# EAGLE board Blade (EAGLE 9.3.1), part 1 of 2
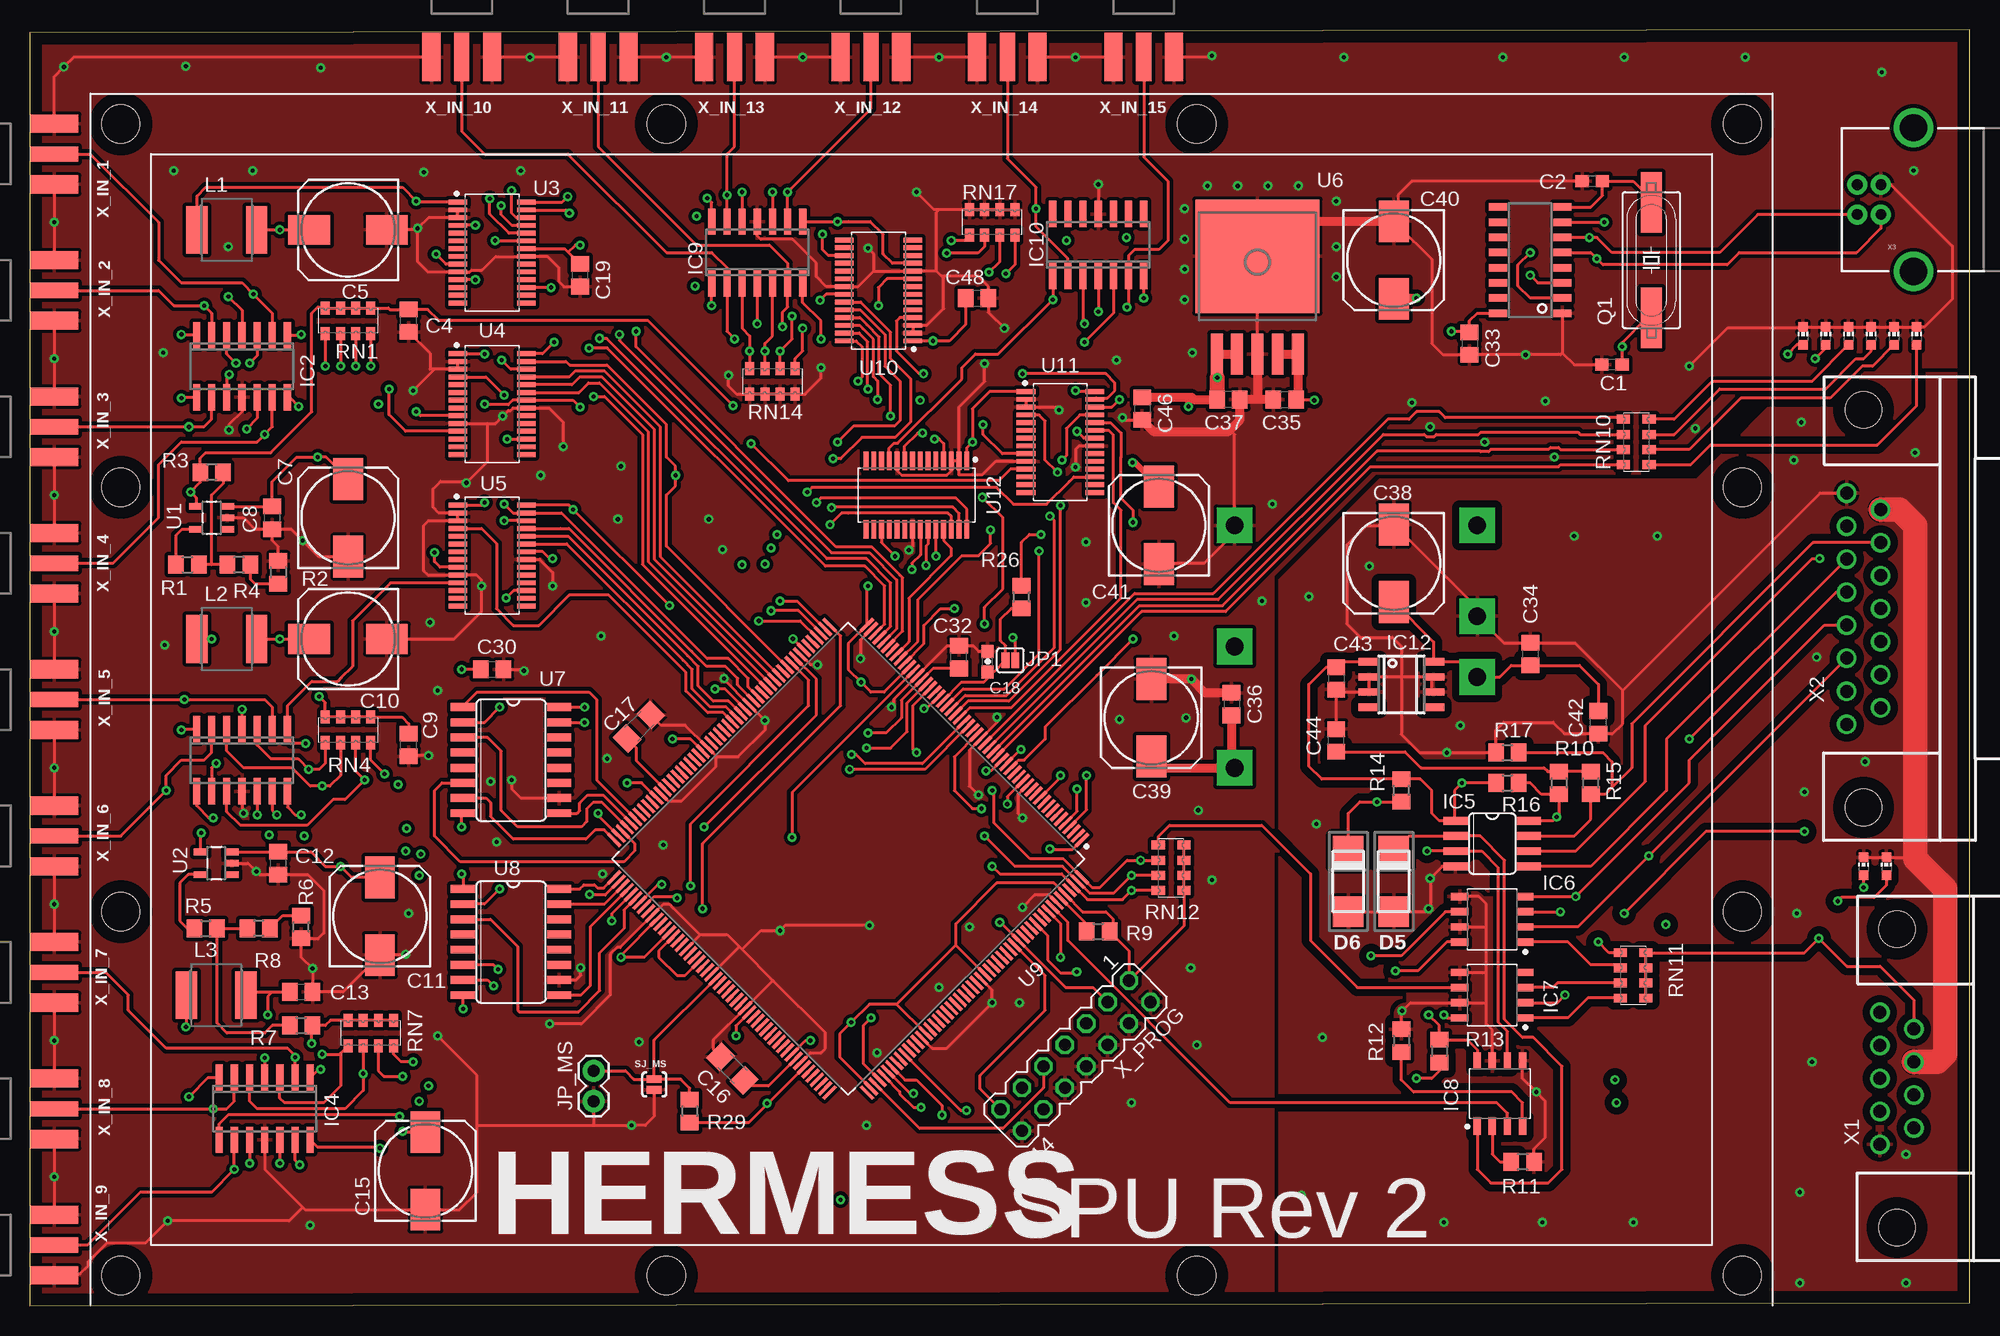
[diagram p8: board, top side]
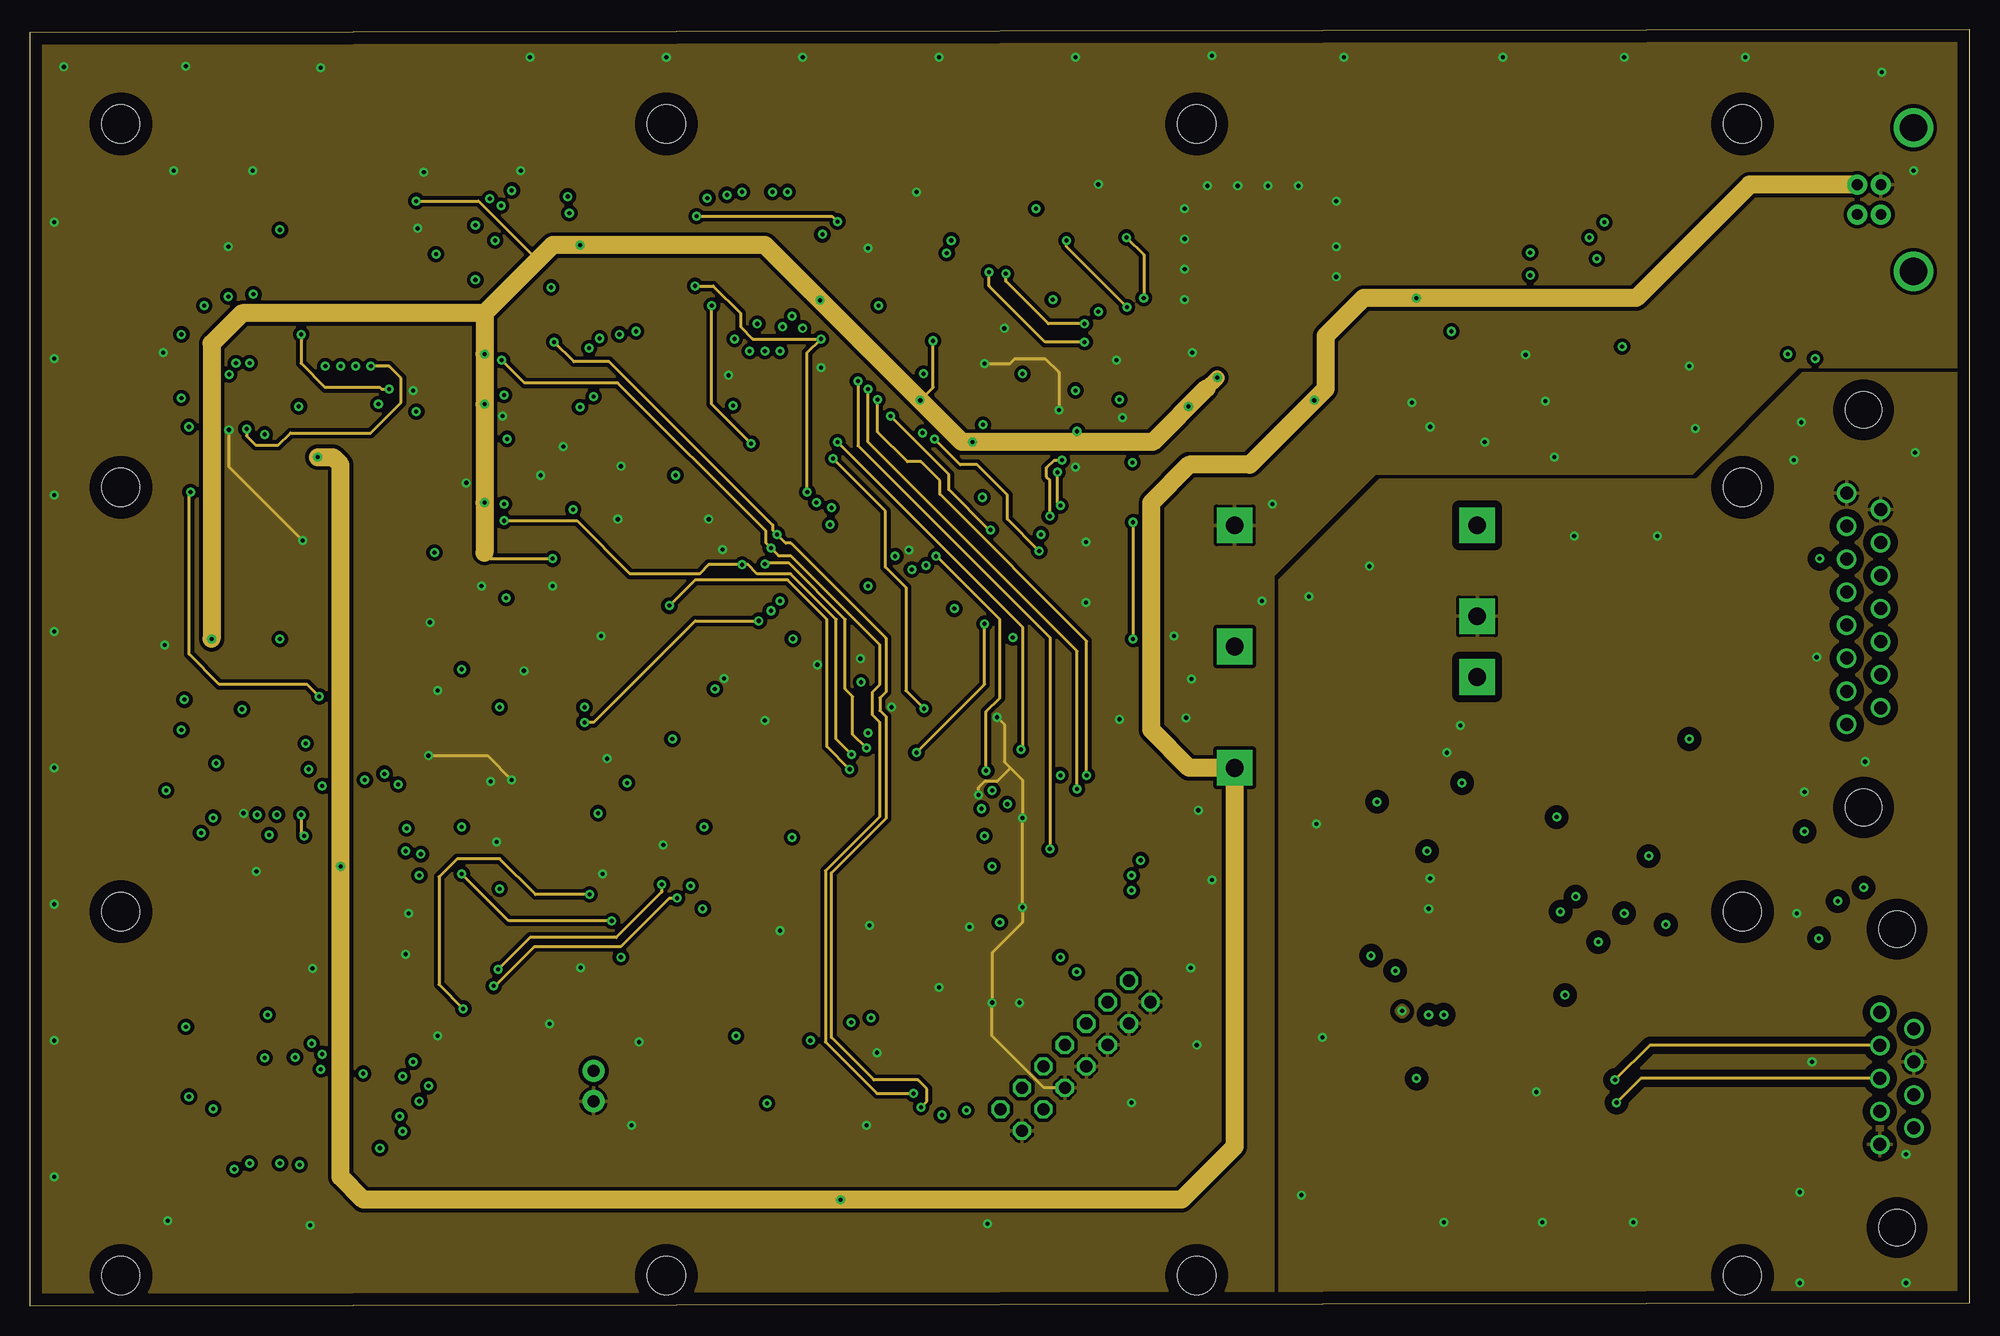
[diagram p9: board, inner layer Route2]
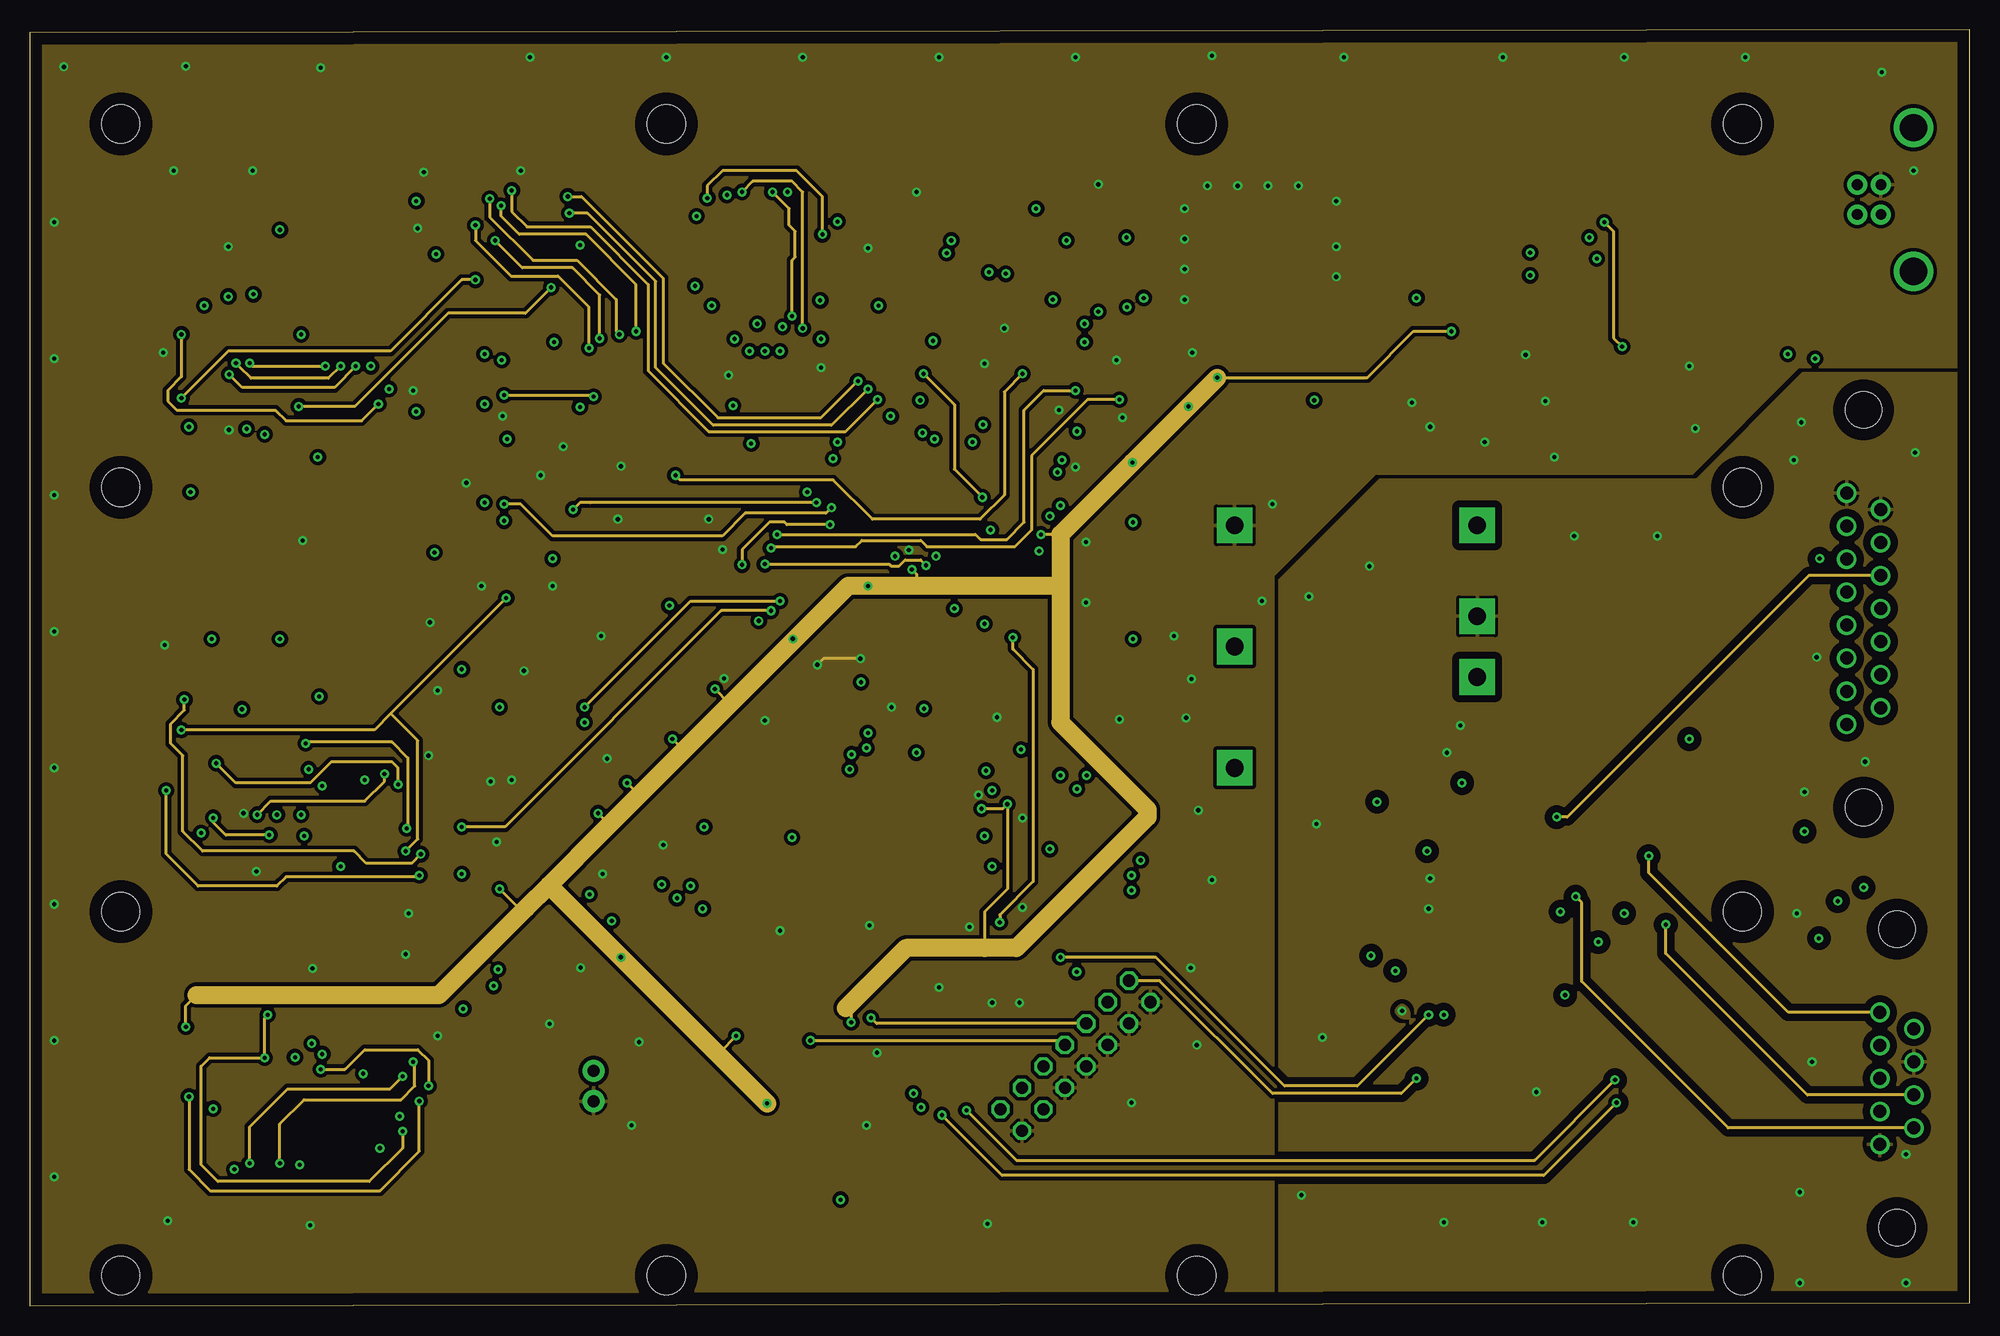
[diagram p10: board, inner layer Route15]
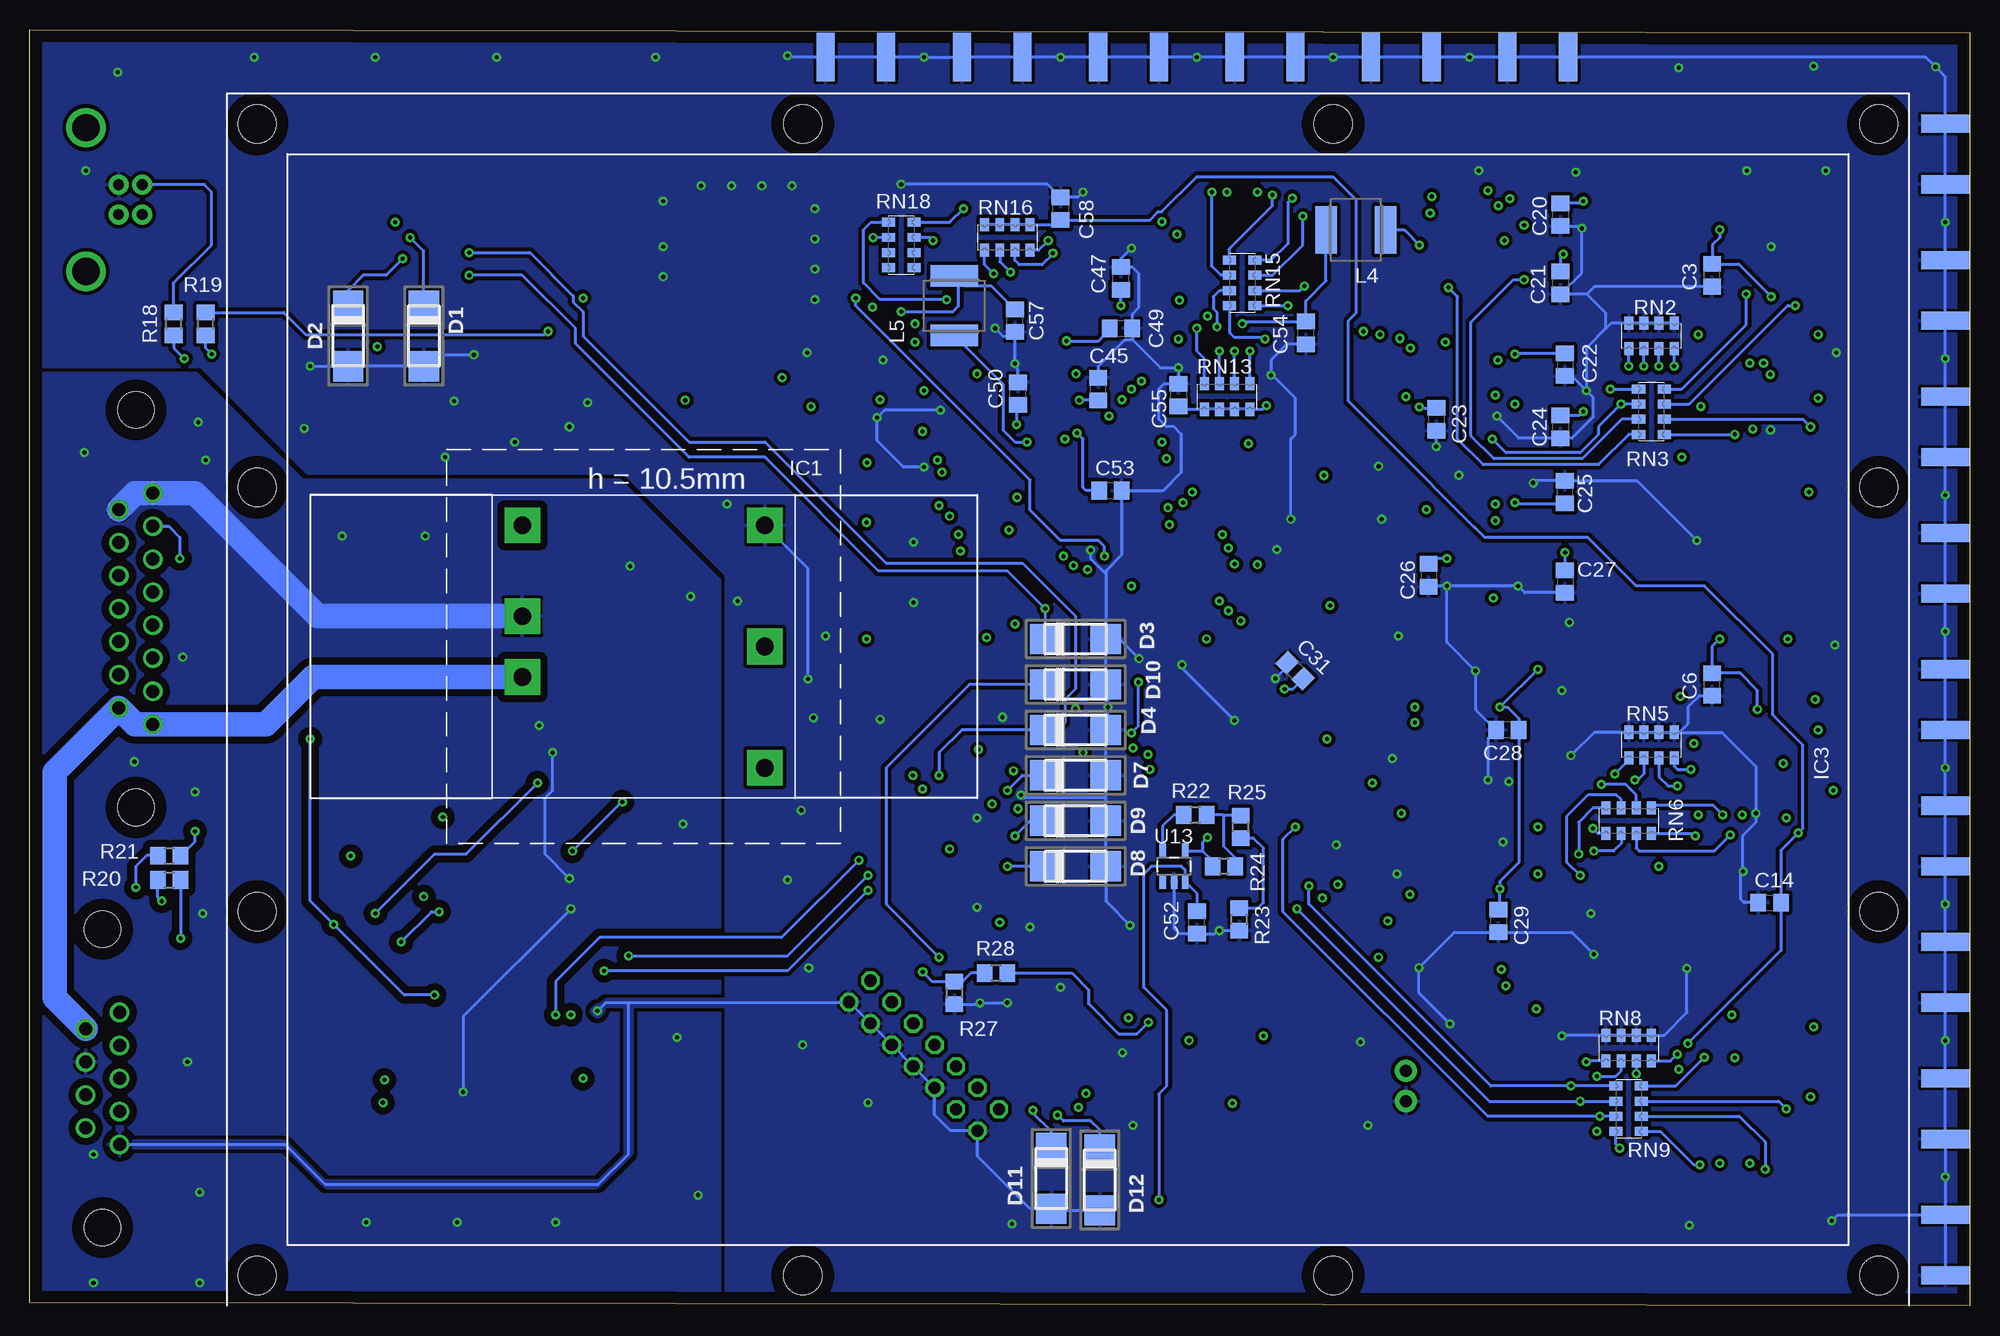
[diagram p11: board, bottom side, seen from below]

Size 162.56 x 106.93 mm. Coordinates in mm from the lower left corner, seen from the top.
Outline: 0,0 162.56,0.25 162.56,106.93 0,106.68 0,0
Copper layers (1+2+15+16): Top 0.035mm / dielectric 0.2mm / Route2 0.017mm / dielectric 0.2mm / Route15 0.017mm / dielectric 0.2mm / Bottom 0.035mm
Design rules "default *": minimum track width 10mil, minimum drill 0.35mm, track to track 9mil, track to pad 8mil, pad to pad 8mil, via to via 12mil, smd to smd 6mil, copper to edge 40mil, drill to drill 6mil, minimum pad ring 10mil, minimum via ring 8mil, stop-mask expansion 4mil, vias tented up to drill 0mil, thermal gap 10mil
Holes 3.2 mm at 7.62,99.06 7.62,2.54 143.51,2.54 143.51,99.06 53.34,99.06 97.79,99.06 53.34,2.54 97.79,2.54 7.62,68.58 7.62,33.02 143.51,33.02 143.51,68.58
tKeepout: area 5.1,0 to 146.1,101.6

## Footprints (pad centres in the part's own frame; a part is rotated, then mirrored left to right if it is on the bottom)
C0603 = smd 1.1 x 1: 1 -0.85,0; 2 0.85,0
C0805 = smd 1.3 x 1.5: 1 -0.95,0; 2 0.95,0
153CLV-0810 = smd 3.5 x 2.5: + 3.25,0; - -3.25,0
C1206 = smd 1.6 x 1.8: 1 -1.4,0; 2 1.4,0
0603-CAP = smd 1.1 x 1: 1 -0.85,0; 2 0.85,0
DMELF = smd 2.54 x 2.54: A -2.54,0; C 2.54,0
THL_20WI_SERIES = drill 1.5 pad 3 square: 1 -2.54,10.16; 2 2.54,10.16; 3 -10.16,-10.16; 4 0,-10.16; 5 10.16,-10.16; 6 10.16,10.16
SO14 = smd 0.6 x 2.2: 1 -3.81,-2.6; 2 -2.54,-2.6; 3 -1.27,-2.6; 4 0,-2.6; 5 1.27,-2.6; 6 2.54,-2.6; 7 3.81,-2.6; 8 3.81,2.6; 9 2.54,2.6; 10 1.27,2.6; 11 0,2.6; 12 -1.27,2.6; 13 -2.54,2.6; 14 -3.81,2.6
SO08 = smd 0.66 x 2.032: 1 -1.905,-3.073; 2 -0.635,-3.073; 3 0.635,-3.073; 4 1.905,-3.073; 5 1.905,3.073; 6 0.635,3.073; 7 -0.635,3.073; 8 -1.905,3.073
SOIC127P594X363-8N = smd 1.44 x 0.614: 1 -2.731,1.905; 2 -2.731,0.635; 3 -2.731,-0.635; 4 -2.731,-1.905; 5 2.731,-1.905; 6 2.731,-0.635; 7 2.731,0.635; 8 2.731,1.905
SOIC8 = smd 0.6 x 1.8: 1 -1.905,-2.7; 2 -0.635,-2.7; 3 0.635,-2.7; 4 1.905,-2.7; 5 1.905,2.7; 6 0.635,2.7; 7 -0.635,2.7; 8 -1.905,2.7
SOIC16 = smd 0.635 x 1.524: 1 -4.445,-2.695; 2 -3.175,-2.695; 3 -1.905,-2.695; 4 -0.635,-2.695; 5 0.635,-2.695; 6 1.905,-2.695; 7 3.175,-2.695; 8 4.445,-2.695; 9 4.445,2.695; 10 3.175,2.695; 11 1.905,2.695; 12 0.635,2.695; 13 -0.635,2.695; 14 -1.905,2.695; 15 -3.175,2.695; 16 -4.445,2.695
SMT-JUMPER_2_NC_PASTE_SILK = smd 0.635 x 1.27: 1 -0.406,0; 2 0.406,0
1X02 = drill 1.016 pad 1.88: 1 0,0; 2 2.54,0
L5650M = smd 1.8 x 4: 1 -2.5,0; 2 2.5,0
CHIP-LED0603 = smd 0.8 x 0.8: A 0,-0.75; C 0,0.75
SM49 = smd 5.08 x 1.778: 1 -4.826,0; 2 4.826,0
R0805 = smd 1.3 x 1.5: 1 -0.95,0; 2 0.95,0
EXBS8V = smd 0.75 x 1.1: 1 -1.905,-1.07; 2 -0.635,-1.07; 3 0.635,-1.07; 4 1.905,-1.07; 5 1.905,1.07; 6 0.635,1.07; 7 -0.635,1.07; 8 -1.905,1.07
SJ_2S-NO = smd 0.635 x 1.27: 1 -0.45,0; 2 0.45,0
SOT23-5 = smd 0.55 x 1.2: 1 -0.95,-1.3; 2 0,-1.3; 3 0.95,-1.3; 4 0.95,1.3; 5 -0.95,1.3
TSSOP28 = smd 1.572 x 0.407: 1 -2.872,4.225; 2 -2.872,3.575; 3 -2.872,2.925; 4 -2.872,2.275; 5 -2.872,1.625; 6 -2.872,0.975; 7 -2.872,0.325; 8 -2.872,-0.325; 9 -2.872,-0.975; 10 -2.872,-1.625; 11 -2.872,-2.275; 12 -2.872,-2.925; 13 -2.872,-3.575; 14 -2.872,-4.225; 15 2.872,-4.225; 16 2.872,-3.575; 17 2.872,-2.925; 18 2.872,-2.275; 19 2.872,-1.625; 20 2.872,-0.975; 21 2.872,-0.325; 22 2.872,0.325; 23 2.872,0.975; 24 2.872,1.625; 25 2.872,2.275; 26 2.872,2.925; 27 2.872,3.575; 28 2.872,4.225
Q5-DD = smd 1 x 3.4: 1 -3.4,-7.875; 2 -1.7,-7.875; 3 0,-7.875; 4 1.7,-7.875; 5 3.4,-7.875 | smd 10.414 x 9.525: 6 0,0.325
SO16 = smd 0.66 x 2.032: 1 -4.445,-3.073; 2 -3.175,-3.073; 3 -1.905,-3.073; 4 -0.635,-3.073; 5 0.635,-3.073; 6 1.905,-3.073; 7 3.175,-3.073; 8 4.445,-3.073; 9 4.445,4.978; 10 3.175,4.978; 11 1.905,4.978; 12 0.635,4.978; 13 -0.635,4.978; 14 -1.905,4.978; 15 -3.175,4.978; 16 -4.445,4.978
QFP50P3060X3060X385-208 = smd 1.469 x 0.28: 1 -14.971,12.75; 2 -14.971,12.25; 3 -14.971,11.75; 4 -14.971,11.25; 5 -14.971,10.75; 6 -14.971,10.25; 7 -14.971,9.75; 8 -14.971,9.25; 9 -14.971,8.75; 10 -14.971,8.25; 11 -14.971,7.75; 12 -14.971,7.25; 13 -14.971,6.75; 14 -14.971,6.25; 15 -14.971,5.75; 16 -14.971,5.25; 17 -14.971,4.75; 18 -14.971,4.25; 19 -14.971,3.75; 20 -14.971,3.25; 21 -14.971,2.75; 22 -14.971,2.25; 23 -14.971,1.75; 24 -14.971,1.25; 25 -14.971,0.75; 26 -14.971,0.25; 27 -14.971,-0.25; 28 -14.971,-0.75; 29 -14.971,-1.25; 30 -14.971,-1.75; 31 -14.971,-2.25; 32 -14.971,-2.75; 33 -14.971,-3.25; 34 -14.971,-3.75; 35 -14.971,-4.25; 36 -14.971,-4.75; 37 -14.971,-5.25; 38 -14.971,-5.75; 39 -14.971,-6.25; 40 -14.971,-6.75; 41 -14.971,-7.25; 42 -14.971,-7.75; 43 -14.971,-8.25; 44 -14.971,-8.75; 45 -14.971,-9.25; 46 -14.971,-9.75; 47 -14.971,-10.25; 48 -14.971,-10.75; 49 -14.971,-11.25; 50 -14.971,-11.75; 51 -14.971,-12.25; 52 -14.971,-12.75; 105 14.971,-12.75; 106 14.971,-12.25; 107 14.971,-11.75; 108 14.971,-11.25; 109 14.971,-10.75; 110 14.971,-10.25; 111 14.971,-9.75; 112 14.971,-9.25; 113 14.971,-8.75; 114 14.971,-8.25; 115 14.971,-7.75; 116 14.971,-7.25; 117 14.971,-6.75; 118 14.971,-6.25; 119 14.971,-5.75; 120 14.971,-5.25; 121 14.971,-4.75; 122 14.971,-4.25; 123 14.971,-3.75; 124 14.971,-3.25; 125 14.971,-2.75; 126 14.971,-2.25; 127 14.971,-1.75; 128 14.971,-1.25; 129 14.971,-0.75; 130 14.971,-0.25; 131 14.971,0.25; 132 14.971,0.75; 133 14.971,1.25; 134 14.971,1.75; 135 14.971,2.25; 136 14.971,2.75; 137 14.971,3.25; 138 14.971,3.75; 139 14.971,4.25; 140 14.971,4.75; 141 14.971,5.25; 142 14.971,5.75; 143 14.971,6.25; 144 14.971,6.75; 145 14.971,7.25; 146 14.971,7.75; 147 14.971,8.25; 148 14.971,8.75; 149 14.971,9.25; 150 14.971,9.75; 151 14.971,10.25; 152 14.971,10.75; 153 14.971,11.25; 154 14.971,11.75; 155 14.971,12.25; 156 14.971,12.75 | smd 0.28 x 1.469: 53 -12.75,-14.971; 54 -12.25,-14.971; 55 -11.75,-14.971; 56 -11.25,-14.971; 57 -10.75,-14.971; 58 -10.25,-14.971; 59 -9.75,-14.971; 60 -9.25,-14.971; 61 -8.75,-14.971; 62 -8.25,-14.971; 63 -7.75,-14.971; 64 -7.25,-14.971; 65 -6.75,-14.971; 66 -6.25,-14.971; 67 -5.75,-14.971; 68 -5.25,-14.971; 69 -4.75,-14.971; 70 -4.25,-14.971; 71 -3.75,-14.971; 72 -3.25,-14.971; 73 -2.75,-14.971; 74 -2.25,-14.971; 75 -1.75,-14.971; 76 -1.25,-14.971; 77 -0.75,-14.971; 78 -0.25,-14.971; 79 0.25,-14.971; 80 0.75,-14.971; 81 1.25,-14.971; 82 1.75,-14.971; 83 2.25,-14.971; 84 2.75,-14.971; 85 3.25,-14.971; 86 3.75,-14.971; 87 4.25,-14.971; 88 4.75,-14.971; 89 5.25,-14.971; 90 5.75,-14.971; 91 6.25,-14.971; 92 6.75,-14.971; 93 7.25,-14.971; 94 7.75,-14.971; 95 8.25,-14.971; 96 8.75,-14.971; 97 9.25,-14.971; 98 9.75,-14.971; 99 10.25,-14.971; 100 10.75,-14.971; 101 11.25,-14.971; 102 11.75,-14.971; 103 12.25,-14.971; 104 12.75,-14.971; 157 12.75,14.971; 158 12.25,14.971; 159 11.75,14.971; 160 11.25,14.971; 161 10.75,14.971; 162 10.25,14.971; 163 9.75,14.971; 164 9.25,14.971; 165 8.75,14.971; 166 8.25,14.971; 167 7.75,14.971; 168 7.25,14.971; 169 6.75,14.971; 170 6.25,14.971; 171 5.75,14.971; 172 5.25,14.971; 173 4.75,14.971; 174 4.25,14.971; 175 3.75,14.971; 176 3.25,14.971; 177 2.75,14.971; 178 2.25,14.971; 179 1.75,14.971; 180 1.25,14.971; 181 0.75,14.971; 182 0.25,14.971; 183 -0.25,14.971; 184 -0.75,14.971; 185 -1.25,14.971; 186 -1.75,14.971; 187 -2.25,14.971; 188 -2.75,14.971; 189 -3.25,14.971; 190 -3.75,14.971; 191 -4.25,14.971; 192 -4.75,14.971; 193 -5.25,14.971; 194 -5.75,14.971; 195 -6.25,14.971; 196 -6.75,14.971; 197 -7.25,14.971; 198 -7.75,14.971; 199 -8.25,14.971; 200 -8.75,14.971; 201 -9.25,14.971; 202 -9.75,14.971; 203 -10.25,14.971; 204 -10.75,14.971; 205 -11.25,14.971; 206 -11.75,14.971; 207 -12.25,14.971; 208 -12.75,14.971
H5M09RA = drill 1.092: 1 -5.537,1.422; 2 -2.769,1.422; 3 0,1.422; 4 2.769,1.422; 5 5.537,1.422; 6 -4.153,-1.422; 7 -1.384,-1.422; 8 1.384,-1.422; 9 4.153,-1.422 | hole 3.048: -12.497,0; 12.497,0
H5M15RA = drill 1.092: 1 -9.69,1.422; 2 -6.921,1.422; 3 -4.153,1.422; 4 -1.384,1.422; 5 1.384,1.422; 6 4.153,1.422; 7 6.921,1.422; 8 9.69,1.422; 9 -8.306,-1.422; 10 -5.537,-1.422; 11 -2.769,-1.422; 12 0,-1.422; 13 2.769,-1.422; 14 5.537,-1.422; 15 8.306,-1.422 | hole 3.048: -16.662,0; 16.662,0
USB-B-PTH = drill 0.914 pad 1.676: D+ 0,1.25; D- 1.981,1.25; GND 0,-1.25; VBUS 1.981,-1.25 | drill 2.286: S1 -2.718,-6.02; S2 -2.718,6.02
SMA_EDGELAUNCH = smd 4.064 x 1.524: GND@1 2.032,-2.54; GND@2 2.032,2.54 | smd 4.064 x 1.524 bottom: GND@3 2.032,2.54; GND@4 2.032,-2.54 | smd 4.064 x 1.27: P 2.032,0
MA07-2 = drill 1.016 octagon: 1 -7.62,-1.27; 2 -7.62,1.27; 3 -5.08,-1.27; 4 -5.08,1.27; 5 -2.54,-1.27; 6 -2.54,1.27; 7 0,-1.27; 8 0,1.27; 9 2.54,-1.27; 10 2.54,1.27; 11 5.08,-1.27; 12 5.08,1.27; 13 7.62,-1.27; 14 7.62,1.27

## Placement (x,y rotation side)
C1  22p  [C0603]  132.59,78.87 180 top
C2  22p  [C0603]  130.94,94.23 180 top
C3  10n  [C0805]  21.59,86.36 90 bottom
C4  10u  [C0805]  31.75,82.55 90 top
C5  10u  [153CLV-0810]  26.67,90.17 180 top
C6  10n  [C0805]  21.59,52.07 90 bottom
C7  4u7  [153CLV-0810]  26.67,66.04 90 top
C8  10n  [C0805]  20.32,66.04 90 top
C9  10u  [C0805]  31.75,46.99 90 top
C10  10u  [153CLV-0810]  26.67,55.88 180 top
C11  4u7  [153CLV-0810]  29.34,32.64 90 top
C12  10n  [C0805]  20.83,37.08 90 top
C13  10n  [C0805]  22.73,26.29 180 top
C14  10u  [C0805]  16.76,33.78 0 bottom
C15  10u  [153CLV-0810]  33.15,11.3 90 top
C16  2.2u  [C1206]  58.87,19.87 315 top
C17  2.2u  [C1206]  51.04,48.53 225 top
C18  100n  [0603-CAP]  80.26,53.98 90 top
C19  100n  [C0805]  46.1,86.36 270 top
C20  100n  [C0805]  34.29,91.44 270 bottom
C21  1u  [C0805]  34.29,85.72 270 bottom
C22  100n  [C0805]  33.91,78.87 270 bottom
C23  100n  [C0805]  44.7,74.3 270 bottom
C24  1u  [C0805]  34.29,73.66 270 bottom
C25  100n  [C0805]  33.91,68.2 90 bottom
C26  100n  [C0805]  45.34,61.21 270 bottom
C27  1u  [C0805]  33.91,60.71 270 bottom
C28  100n  [C0805]  38.73,48.26 180 bottom
C29  100n  [C0805]  39.5,32.26 270 bottom
C30  100n  [C0805]  38.73,53.34 0 top
C31  100n  [C0805]  56.52,53.21 135 bottom
C32  100n  [C0805]  77.85,54.36 90 top
C33  100n  [C0805]  120.65,80.64 270 top
C34  100n  [C0805]  125.73,54.61 270 top
C35  100n  [C0805]  105.16,75.95 0 top
C36  100n  [C0805]  100.71,50.42 270 top
C37  100n  [C0805]  100.46,75.95 180 top
C38  10u  [153CLV-0810]  114.3,62.23 270 top
C39  10u  [153CLV-0810]  93.98,49.28 270 top
C40  10u  [153CLV-0810]  114.3,87.63 270 top
C41  10u  [153CLV-0810]  94.61,65.41 90 top
C42  100n  [C0805]  131.44,48.9 90 top
C43  100n  [C0805]  109.47,52.58 270 top
C44  ~0  [C0805]  109.47,47.37 90 top
C45  100n  [C0805]  73.03,76.83 90 bottom
C46  100n  [C0805]  93.22,75.18 270 top
C47  1u  [C0805]  71.12,86.11 90 bottom
C48  100n  [C0805]  79.38,84.45 0 top
C49  100n  [C0805]  71.12,81.92 0 bottom
C50  1u  [C0805]  79.76,76.45 90 bottom
C52  10n  [C0805]  64.77,32.13 90 bottom
C53  1u  [C0805]  72.01,68.33 0 bottom
C54  10n  [C0805]  55.63,81.53 90 bottom
C55  10u  [C0805]  66.29,76.33 270 bottom
C57  10n  [C0805]  80.01,82.55 90 bottom
C58  10u  [C0805]  76.2,91.95 270 bottom
D1  6V  [DMELF]  129.54,81.28 90 bottom
D2  6V  [DMELF]  135.89,81.28 90 bottom
D3  3V6  [DMELF]  74.93,55.88 180 bottom
D4  3V6  [DMELF]  74.93,48.26 180 bottom
D5  6V  [DMELF]  114.3,35.56 90 top
D6  6V  [DMELF]  110.49,35.56 90 top
D7  3V6  [DMELF]  74.93,44.45 180 bottom
D8  3V6  [DMELF]  74.93,36.83 180 bottom
D9  3V6  [DMELF]  74.93,40.64 180 bottom
D10  3V6  [DMELF]  74.93,52.07 180 bottom
D11  3V6  [DMELF]  76.96,10.67 90 bottom
D12  3V6  [DMELF]  72.9,10.54 90 bottom
IC1  THN10-2411WIR  [THL_20WI_SERIES]  111.12,55.24 90 bottom
IC2  MCP6064-E/SL  [SO14]  17.78,78.74 180 top
IC3  MCP6064-E/SL  [SO14]  17.78,45.72 180 top
IC4  MCP6064-E/SL  [SO14]  19.68,16.51 180 top
IC5  MAX488CSA  [SO08]  122.56,38.73 270 top
IC6  MOCD207MSOIC-8  [SOIC127P594X363-8N]  122.56,32.38 180 top
IC7  MOCD207MSOIC-8  [SOIC127P594X363-8N]  122.56,26.04 180 top
IC8  MOCD207MSOIC-8  [SOIC127P594X363-8N]  123.19,17.78 90 top
IC9  MCP6064-E/SL  [SO14]  60.96,88.27 0 top
IC10  MCP6064-E/SL  [SO14]  89.53,88.9 0 top
IC12  LM78L05ACMX/NOPB  [SOIC8]  114.94,52.07 270 top
IC13  CH340G  [SOIC16]  125.73,87.63 90 top
JP1  JUMPER-SMT_2_NC_PASTE_SILK  [SMT-JUMPER_2_NC_PASTE_SILK]  82.17,54.1 0 top
JP_MS  [1X02]  47.24,17.14 90 top
L1  1m  [L5650M]  16.51,90.17 0 top
L2  1m  [L5650M]  16.51,55.88 0 top
L3  1m  [L5650M]  15.62,26.04 0 top
L4  1m  [L5650M]  51.44,90.17 180 bottom
L5  1m  [L5650M]  85.09,83.82 90 bottom
LED1  1V9  [CHIP-LED0603]  152.4,81.28 0 top
LED2  1V9  [CHIP-LED0603]  154.31,81.28 0 top
LED3  1V9  [CHIP-LED0603]  156.21,81.28 0 top
LED4  1V9  [CHIP-LED0603]  158.12,81.28 0 top
LED5  1V9  [CHIP-LED0603]  150.5,81.28 0 top
LED6  1V9  [CHIP-LED0603]  148.59,81.28 0 top
LED7  [CHIP-LED0603]  155.57,36.83 0 top
LED8  [CHIP-LED0603]  153.67,36.83 0 top
Q1  12MHz  [SM49]  135.89,87.63 90 top
R1  100k  [R0805]  13.21,62.1 0 top
R2  1k  [R0805]  20.83,61.47 270 top
R3  ?  [R0805]  15.24,69.85 180 top
R4  ?  [R0805]  17.53,62.1 180 top
R5  100k  [R0805]  14.73,31.62 0 top
R6  1k  [R0805]  22.73,31.75 90 top
R7  ?  [R0805]  22.73,23.5 0 top
R8  ?  [R0805]  19.18,31.62 180 top
R9  10k  [R0805]  89.53,31.37 0 top
R10  500  [R0805]  128.14,43.81 270 top
R11  3k  [R0805]  125.09,12.06 180 top
R12  2k  [R0805]  114.94,22.23 270 top
R13  4k7  [R0805]  118.11,21.34 270 top
R14  7k5  [R0805]  114.94,43.18 90 top
R15  500  [R0805]  130.81,43.81 90 top
R16  3k3  [R0805]  123.83,43.81 0 top
R17  3k3  [R0805]  123.83,46.35 0 top
R18  680  [R0805]  150.5,82.3 90 bottom
R19  330  [R0805]  147.83,82.3 90 bottom
R20  4k7  [R0805]  150.88,35.69 0 bottom
R21  470  [R0805]  150.88,37.72 0 bottom
R22  100k  [R0805]  64.9,41.15 0 bottom
R23  1k  [R0805]  61.21,32.38 90 bottom
R24  ?  [R0805]  62.48,36.83 180 bottom
R25  ?  [R0805]  61.09,40.13 90 bottom
R26  10k  [R0805]  83.11,59.4 90 top
R27  10k  [R0805]  85.09,26.23 270 bottom
R28  99M  [R0805]  81.6,27.88 180 bottom
R29  10k  [R0805]  55.3,16.31 270 top
RN1  ?  [EXBS8V]  26.67,82.55 180 top
RN2  ?  [EXBS8V]  26.67,81.28 0 bottom
RN3  ?  [EXBS8V]  26.67,74.93 90 bottom
RN4  ?  [EXBS8V]  26.67,48.26 180 top
RN5  ?  [EXBS8V]  26.67,46.99 0 bottom
RN6  ?  [EXBS8V]  28.57,40.64 180 bottom
RN7  ?  [EXBS8V]  28.57,22.86 180 top
RN8  ?  [EXBS8V]  28.57,21.59 0 bottom
RN9  ?  [EXBS8V]  28.57,16.51 90 bottom
RN10  330  [EXBS8V]  134.62,72.39 270 top
RN11  3k  [EXBS8V]  134.37,27.69 90 top
RN12  300  [EXBS8V]  95.63,36.7 90 top
RN13  ?  [EXBS8V]  62.23,76.2 0 bottom
RN14  ?  [EXBS8V]  62.23,77.47 180 top
RN15  ?  [EXBS8V]  60.96,85.72 270 bottom
RN16  ?  [EXBS8V]  80.64,89.53 180 bottom
RN17  ?  [EXBS8V]  80.64,90.81 0 top
RN18  ?  [EXBS8V]  89.53,88.9 90 bottom
SJ_MS  [SJ_2S-NO]  52.32,18.54 90 top
U1  ADR366WAUJZ  [SOT23-5]  15.24,66.04 90 top
U2  ADR366WAUJZ  [SOT23-5]  15.62,37.08 90 top
U3  ADS1148QPWRQ1  [TSSOP28]  38.73,88.27 0 top
U4  ADS1148QPWRQ1  [TSSOP28]  38.73,75.56 0 top
U5  ADS1148QPWRQ1  [TSSOP28]  38.73,62.87 0 top
U6  LT1528  [Q5-DD]  102.87,87.63 0 top
U7  S70FL01GS  [SO16]  39.37,45.72 270 top
U8  S70FL01GS  [SO16]  39.37,30.48 270 top
U9  STM32F77XXXLQFP208  [QFP50P3060X3060X385-208]  68.58,37.47 225 top
U10  ADS1148QPWRQ1  [TSSOP28]  71.12,85.09 180 top
U11  ADS1148QPWRQ1  [TSSOP28]  86.36,72.39 0 top
U12  ADS1148QPWRQ1  [TSSOP28]  74.3,67.94 270 top
U13  ADR366WAUJZ  [SOT23-5]  66.67,36.83 0 bottom
X1  D-SUB9-H5M09RA  [H5M09RA]  156.46,19.05 90 top
X2  D-SUB15-H5M15RA  [H5M15RA]  153.67,58.42 90 top
X3  USBPTH  [USB-B-PTH]  155.13,92.71 180 top
X_IN_1  [SMA_EDGELAUNCH]  0,96.52 0 top
X_IN_2  [SMA_EDGELAUNCH]  0,85.09 0 top
X_IN_3  [SMA_EDGELAUNCH]  0,73.66 0 top
X_IN_4  [SMA_EDGELAUNCH]  0,62.23 0 top
X_IN_5  [SMA_EDGELAUNCH]  0,50.8 0 top
X_IN_6  [SMA_EDGELAUNCH]  0,39.37 0 top
X_IN_7  [SMA_EDGELAUNCH]  0,27.94 0 top
X_IN_8  [SMA_EDGELAUNCH]  0,16.51 0 top
X_IN_9  [SMA_EDGELAUNCH]  0,5.08 0 top
X_IN_10  [SMA_EDGELAUNCH]  36.2,106.68 270 top
X_IN_11  [SMA_EDGELAUNCH]  47.62,106.68 270 top
X_IN_12  [SMA_EDGELAUNCH]  70.48,106.68 270 top
X_IN_13  [SMA_EDGELAUNCH]  59.05,106.68 270 top
X_IN_14  [SMA_EDGELAUNCH]  81.92,106.68 270 top
X_IN_15  [SMA_EDGELAUNCH]  93.34,106.68 270 top
X_PROG  [MA07-2]  87.63,20.95 225 top

## Tracks (layer width: path | path; a pad name or v marks a point on that pad's centre or on a via)
3V3  (via drill 0.35)
  Top 0.254: R9.2 90.77,31.08 | 90.77,31.08 92.12,29.73 X_PROG.1 96.7,31.82 RN12.1 RN12.2 RN12.3 RN12.4 | 90.77,31.08 90.77,32.42 90.17,33.02 88.23,33.02 U9.204 85.81,35.43 81.02,35.43 77.59,32.01 77.59,30.23 | R13.2 118.11,19.68 117.47,19.05 v116.2,19.05 | U9.73 58.24,51.69 v57.4,51.69 | C32.1 75.68,53.41 U9.39 73.05,50.77 73.05,50.75 73.03,50.73 73.03,49.28 71.75,48.01 v70.23,48.01 | IC13.16 121.28,83.19 120.65,82.55 C33.1 120.58,81.66 v119.13,81.66 | U9.158 67.86,20.86 67.86,22.77 v68.83,23.75 70.36,25.27 72.64,25.27 | U9.171 72.64,25.27 | 72.64,25.27 77.59,30.23 | U9.185 77.59,30.22 77.59,30.23 | U9.83 55.37,47.5 v53.85,47.5 | U9.94 51.27,43.81 v50.04,43.81 | U9.103 47.62,41.1 v47.62,41.27 | U9.115 49.53,29.38 v49.53,29.21 51.49,29.21 U9.118 | U9.137 59.18,23.47 v59.18,22.61 | U9.150 61.86,16.95 | 61.86,16.95 v61.78,16.95 | U9.15 81.92,42.67 v81.92,42.04 | U9.26 77.47,46 77.47,43.18 78.99,41.66 v79.76,41.66 | U9.42 71.59,51.44 70.48,51.44 v69.66,52.26 68.58,53.34 68.58,55.5 U9.52 70.15,60.24 v70.23,60.33 | U9.59 v63.94,55.89 | U12.1 78.52,71.92 v78.99,72.39 78.99,75.18 80.42,76.61 U11.1 | C48.1 78.42,82.23 77.06,80.86 v75.69,80.86 U10.1 | U10.22 66.73,84.77 v66.23,84.26 | U3.22 44.82,88.59 45.12,88.3 | C19.1 45.12,88.3 | 45.12,88.3 45.72,88.9 v46.1,88.9 | U3.1 32.48,92.49 v32.38,92.58 31.24,93.73 14.73,93.73 14.01,93 L1.1 | U4.1 38.07,79.79 v38.1,79.76 | v39.37,34.92 38.1,33.66 U8.2 | U7.2 38.1,48.9 v39.37,50.16 | U5.22 42.98,63.19 43.56,62.61 v43.81,62.61 | C30.1 v36.2,53.34 | U5.1 37.88,67.09 v38.1,67.31 | v38.1,75.56 38.15,75.52 40.09,75.52 40.46,75.89 U4.22 45.52,75.89 v46.1,75.31 | L2.1 v15.24,55.88
  Top 0.254: L3.1 13.12,23.41 v13.08,23.37 | U12.22 74.62,62.94 73.91,62.23 v73.91,61.7 | U11.22 88.33,72.72 v87.76,73.28 | R26.2 83.11,63.99 83.76,64.64 v84.73,64.64 | R29.2 60.26,15.36 61.86,16.95
  Top 0.508: v97.09,75.37 97.09,75.88 97.35,76.13 | C41.+ 92.6,70.67 v92.39,70.67
  Top 0.762: U6.1 99.57,79.75 | 99.57,79.75 U6.2 | 99.57,79.75 99.44,79.63 99.44,77.78 v99.51,77.78 | C46.1 97.35,76.13 97.54,75.95 C37.2
  Top 1.27: C37.2 v99.51,77.78
  Route2 0.254: v32.38,92.58 37.59,92.58 42.55,87.63 | 38.1,63.12 38.61,62.61 v43.81,62.61 | v74.61,75.88 75.69,76.96 v75.69,80.86 | v87.76,73.28 87.63,73.15 87.63,72.39
  Route2 1.27: 98.62,76.9 v99.51,77.78
  Route2 1.524: 98.62,76.9 94.11,72.39 87.63,72.39 v78.99,72.39 78.11,72.39 v74.61,75.88 v66.23,84.26 61.59,88.9 v46.1,88.9 43.81,88.9 42.55,87.63 38.1,83.19 | 38.1,83.19 17.78,83.19 15.24,80.64 v15.24,55.88 | 38.1,83.19 v38.1,79.76 v38.1,75.56 v38.1,67.31 38.1,63.12
  Route15 0.254: v116.2,19.05 114.94,17.78 104.14,17.78 94.68,27.24 X_PROG.1 | 54.61,46.35 54.61,46.74 v53.85,47.5 | v50.04,43.81 50.8,43.05 50.8,42.55 | v47.62,41.27 48.26,40.64 48.26,40.01 | v59.18,22.61 57.78,21.21 57.78,20.95 | 68.39,24.96 68.83,24.51 v68.83,23.75 | 80.01,29.97 80.01,33.02 81.92,34.92 v81.92,42.04 81.53,41.66 v79.76,41.66 | v63.94,55.89 64.15,55.89 64.77,56.52 | 41.59,33.34 40.96,33.34 v39.37,34.92 | 58.74,50.48 58.61,50.48 v57.4,51.69 | v13.08,23.37 13.08,25.15 13.97,26.04 | v99.51,77.78 112.08,77.78 115.95,81.66 v119.13,81.66 | v73.91,61.7 74.3,61.32 74.3,60.33 | 86.36,64.64 v84.74,64.64 v84.73,64.64
  Route15 1.524: v99.51,77.78 v92.39,70.67 86.36,64.64 86.36,60.33 | 86.36,60.33 86.36,48.9 93.66,41.59 93.66,40.96 82.68,29.97 80.01,29.97 73.41,29.97 68.39,24.96 | 86.36,60.33 74.3,60.33 v70.23,60.33 68.58,60.33 64.77,56.52 58.74,50.48 54.61,46.35 50.8,42.55 48.26,40.01 43.5,35.24 | 13.97,26.04 34.29,26.04 41.59,33.34 43.5,35.24 | 43.5,35.24 v49.53,29.21 57.78,20.95 v61.78,16.95
  Bottom 0.254: v78.99,72.39 80.01,72.39 81.03,73.41 81.03,77.26 L5.1 | L4.1 47.37,90.17 v46.1,88.9 | v32.38,92.58 32.58,92.39 C20.1 | C22.1 38.04,79.82 v38.1,79.76 | C29.1 39.37,33.34 v39.37,34.92 39.37,35.56 37.78,37.15 C28.1 37.78,49.22 38.73,50.16 39.24,50.16 | v39.37,50.16 39.24,50.16 | v57.4,51.69 56.7,51.69 C31.1 | v43.81,62.61 44.89,62.61 C26.1 | v36.2,53.34 39.24,50.29 39.24,50.16 | v38.1,67.31 38.04,67.25 C25.1 | v46.1,75.31 46.03,75.25 C23.1 | C49.1 72.07,81.79 72.99,80.86 v75.69,80.86 | C45.1 v74.61,75.89 v74.61,75.88 | v70.23,48.01 69.66,48.58 v69.66,52.26 | R19.2 141.28,83.25 139.45,81.41 119.38,81.41 v119.13,81.66 | R28.1 75.25,27.88 73.85,26.48 73.85,25.34 71.31,22.8 69.79,22.8 v68.83,23.75
3V3REF  (via drill 0.35)
  Top 0.254: C9.2 31.75,48.77 31.19,49.33 RN4.1 RN4.2 RN4.3 RN4.4 24.77,50.55 v24.26,51.05 | v58.93,75.44 51.82,82.55 34.29,82.55 33.34,83.5 C4.2 30.16,83.5 30.05,83.62 RN1.1 RN1.2 RN1.3 RN1.4 24.69,83.69 24.13,83.69 23.62,83.19 23.62,74.93 20.19,71.5 14.73,71.5 14.29,71.06 R3.2 14.29,69.03 v13.46,68.2 13.94,67.72 U1.4
  Route2 0.254: v24.26,51.05 23.24,52.07 15.88,52.07 13.34,54.61 13.34,68.07 v13.46,68.2
  Bottom 0.254: C55.2 66.05,75.13 RN13.1 RN13.2 RN13.3 RN13.4 59.24,75.13 v58.93,75.44
3V3REF2  (via drill 0.35)
  Top 0.254: RN7.1 RN7.2 RN7.3 RN7.4 25.2,23.93 24.77,23.5 R7.2 23.62,23.43 v23.62,21.97 | U2.4 14.32,39.59 v14.35,39.62
  Bottom 0.254: v23.62,21.97 15.81,29.78 C14.2 15.81,38.16 v14.35,39.62 13.97,40.01 13.97,46.99 16.51,49.53 16.51,54.61 22.23,60.33 27.94,60.33 32,64.39 40.64,64.39 41.47,65.22 41.53,65.28 48.45,72.2 52.07,75.82 52.07,82.55 51.44,83.19 51.44,92.71 53.34,94.61 64.77,94.61 67.71,91.67 68.03,91.67 68.7,91 C58.2 76.59,90.61 RN16.1 RN16.2 RN16.3 RN16.4
3V3REF3  (via drill 0.35)
  Top 0.254: U9.41 63.88,43.02 v63.88,39.24
  Bottom 0.254: U13.4 64.29,38.13 | R24.2 63.43,37.27 64.29,38.13 | v63.88,39.24 64.29,38.83 64.29,38.13
5V  (via drill 0.35)
  Top 0.254: C35.2 107.57,75.95 v107.63,75.88 | C11.+ 26.98,35.89 v26.04,36.83 24.77,36.83 23.56,38.03 C12.2 U2.3 | C7.+ 24.84,71.12 v24.13,71.12 22.35,71.12 20.32,69.09 C8.2 U1.3
  Top 0.762: C35.2 106.27,76.11 U6.5 U6.4 | C40.+ 114.38,84.45 v116.2,84.45 | C36.2 100.71,45.34 IC1.3 94.92,45.09 C39.+
  Route2 1.524: X3.VBUS 144.12,93.96 134.62,84.45 v116.2,84.45 111.76,84.45 108.58,81.28 108.58,76.83 v107.63,75.88 102.23,70.48 97.16,70.48 93.98,67.31 93.98,48.26 97.16,45.09 IC1.3 100.97,13.34 96.52,8.89 v67.94,8.89 27.94,8.89 26.04,10.79 v26.04,36.83 26.04,70.48 25.4,71.12 v24.13,71.12
  Bottom 0.254: R18.2 150.5,85.72 147.32,88.9 147.32,93.34 147.94,93.96 X3.VBUS | C52.2 64.77,34.58 U13.3 65.72,36.52 66.04,36.83 68.58,36.83 69.22,36.2 69.22,26.67 67.28,24.74 67.28,18.41 67.94,17.75 v67.94,8.89
5V-28V  (via drill 0.35)
  Top 0.254: IC5.1 119.38,40.64 | 119.38,40.64 118.11,40.64 117.47,41.27 117.47,43.18 116.53,44.13 R14.2 108.27,44.13 107.19,45.21 107.19,52.07 108.65,53.53 C43.1 109.92,53.98 IC12.1 | R16.1 v120.02,43.81 119.38,43.18 119.38,40.64 | v148.72,39.75 140.46,39.75 v133.6,32.89
  Bottom 0.254: R21.2 148.72,38.93 v148.72,39.75 | v133.6,32.89 128.65,37.85 125.98,37.85 v120.02,43.81
28V  (via drill 0.35)
  Top 0.254: C42.2 131.44,52.07 129.85,53.66 C34.2 124.14,53.66 123.19,52.7 121.41,52.7 | IC1.1 121.41,52.7 | C38.+ 117.64,55.65 IC12.8 120.14,53.98 121.41,52.7 | RN11.1 RN11.2 RN11.3 RN11.4 148.72,29.59 v149.93,30.8 152.27,28.45 155.07,28.45 157.89,25.63 X1.9
  Bottom 0.254: R20.2 v149.93,30.8
  Bottom 2.032: IC1.1 138.81,52.7 142.79,48.73 X2.1 153.71,48.73 X2.9 160.48,44.73 160.48,25.79 X1.9
28VGND  (via drill 0.35)
  Top 0.254: R11.1 126.05,13.14 127,14.1 127,17.14 v126.24,17.91 125.09,19.05 IC8.5 | C38.- 114.4,65.38 | 114.4,65.38 121.28,58.49 IC1.2 123.51,55.56 C34.1 129.48,55.56 133.48,51.56 | IC12.7 117.47,52.7 | 117.47,52.7 114.94,52.7 | 114.94,52.7 IC12.2 IC12.3 109.67,51.44 C43.2 C44.2 | IC12.6 117.47,51.59 117.47,52.7 | X2.8 150.03,68.11 133.48,51.56 | 133.48,51.56 133.48,48.77 132.65,47.95 C42.1 128.59,47.95 127.64,48.9 123.51,48.9 122.88,48.26 R17.1 v118.75,46.35 116.46,46.35 114.94,47.88 114.94,52.7 | 114.94,52.7 114.94,55.24 114.17,56.01 111.51,56.01 110.36,57.15 110.36,63.75 111.99,65.38 114.4,65.38 | IC5.4 118.36,36.83 v117.35,35.81 117.35,33.4 v117.22,33.27 116.97,33.02 D5.A D6.A | LED8.C LED7.C 157.87,37.58 157.99,37.47
  Top 2.032: X2.15 156.67,66.73 157.99,65.41 157.99,37.47 160.53,34.92 160.53,21.11 159.85,20.43 X1.8
  Bottom 0.254: v117.35,35.81 119.38,37.85 119.38,42.55 118.75,43.18 v118.75,46.35 | v117.22,33.27 126.24,24.26 v126.24,17.91
  Bottom 2.032: IC1.2 138.43,57.78 148.75,68.11 X2.8 153.71,68.11 X2.15
  other vias: 108.33,22.48 106.55,9.27 118.49,6.99 126.75,6.99 134.37,6.99 148.34,1.91 157.23,1.91 148.34,9.53 157.23,12.7 149.35,20.45 148.08,32.89 148.72,43.05 153.8,45.59 149.73,54.36 157.99,71.5 147.83,70.87 148.46,74.04 136.4,64.52 129.41,64.52 107.19,59.44 112.27,61.98 119.89,48.64 107.82,40.39
  pour Top (isolate 0.61): 162.81,78.11 148.59,78.11 139.7,69.22 113.16,69.22 104.78,60.83 104.78,0 162.81,0
  pour Bottom (isolate 0.61): 113.16,69.22 139.7,69.22 148.59,78.11 162.81,78.11 162.81,0 104.78,0 104.78,60.83
  pour Route2 (isolate 0.61): 113.16,69.22 139.7,69.22 148.59,78.11 162.81,78.11 162.81,0 104.78,0 104.78,60.83
  pour Route15 (isolate 0.61): 113.16,69.22 139.7,69.22 148.59,78.11 162.81,78.11 162.81,0 104.78,0 104.78,60.83
ADC1_DRDY
  Top 0.254: U9.65 52.84,62.75 52.84,73.65 48.15,78.33 45.7,78.33 45.2,77.84 U4.25
ADC1_RES  (via drill 0.35)
  Top 0.254: U9.68 51.34,62.13 51.34,73.03 48.16,76.2 v47.24,76.2 | U4.4 38.24,77.84 v39.75,76.33
  Route15 0.254: v39.75,76.33 47.12,76.33 v47.24,76.2
ADC1_START
  Top 0.254: U9.67 51.84,62.34 51.84,73.23 47.74,77.33 46.81,77.33 46.01,76.54 U4.23
ADC2_DRDY  (via drill 0.35)
  Top 0.254: U3.25 40.4,90.54 39.5,91.44 v39.5,92.2 | U9.47 73.15,56.53 73.15,61.01 73.11,61.05 72.92,61.24 70.56,63.6 67.56,63.6 50.8,80.37 v50.8,81.66
  Route15 0.254: v50.8,81.66 50.8,85.6 46.61,89.79 41.02,89.79 39.5,91.31 v39.5,92.2
ADC2_RES  (via drill 0.35)
  Top 0.254: U9.50 71.63,57.13 71.63,60.33 69.98,61.98 66.67,61.98 48.39,80.26 v46.86,80.26 | v37.34,90.55 35.87,90.55 U3.4
  Route15 0.254: v46.86,80.26 46.86,83.69 44.26,86.3 40.32,86.3 37.34,89.28 v37.34,90.55
ADC2_START  (via drill 0.35)
  Top 0.254: U9.49 72.14,56.93 72.14,60.58 70.1,62.61 66.8,62.61 48.34,81.07 v47.75,81.07 | v38.99,89.28 41.57,89.28 U3.23
  Route15 0.254: v47.75,81.07 47.75,84.71 45.47,87 41.27,87 v38.99,89.28
ADC3_DRDY
  Top 0.254: U9.71 59.31,52.04 59.31,52.58 58.3,53.59 56.72,53.59 55.48,54.84 45.17,65.14 44.45,65.14 U5.25
ADC3_RES
  Top 0.254: U9.76 58.1,49.71 56.8,49.71 54.99,51.51 54.99,53.09 48.51,59.56 45.21,59.56 42.67,57.02 40.51,57.02 39.12,58.42 39.12,63.88 37.86,65.14 U5.4
ADC3_START
  Top 0.254: U9.75 58.33,50.19 57,50.19 55.5,51.69 55.5,53.34 54.74,54.1 45,63.84 U5.23
ADC4_DRDY  (via drill 0.35)
  Top 0.254: U11.25 88,74.67 86.87,73.53 86.87,71.25 v86.49,70.87 | U9.32 78.38,51.16 81.84,51.16 85.85,55.17 85.85,65.79 v85.47,66.17
  Route2 0.254: v85.47,66.17 85.47,69.22 85.22,69.47 85.22,70.23 85.85,70.87 v86.49,70.87
ADC4_RES  (via drill 0.35)
  Top 0.254: U11.4 84.58,74.67 85.09,74.16 85.09,70.87 v86.11,69.85 | v86.36,67.06 86.36,54.99 82.04,50.67 78.61,50.67 U9.31
  Route2 0.254: v86.36,67.06 86.11,67.31 v86.11,69.85
ADC4_START
  Top 0.254: U9.30 78.77,50.13 82.26,50.13 91.44,59.31 91.44,66.67 90.81,67.31 90.81,72.98 90.42,73.36 U11.23
ADC5_DRDY  (via drill 0.35)
  Top 0.254: U10.25 69.55,82.81 70.15,82.22 71.17,81.2 71.17,78.11 72.14,77.14 v72.14,74.55 | U9.44 74.42,55.68 74.42,59.18 78.11,62.87 79.5,62.87 80.52,63.88 v80.52,65.02
  Route2 0.254: v80.52,65.02 80.39,65.02 77.03,68.39 77.03,69.66 v72.14,74.55
ADC5_RES  (via drill 0.35)
  Top 0.254: U10.4 72.91,82.81 72.62,82.53 72.62,80.01 74.52,78.11 v74.88,78.11 | v79.82,67.75 81.53,66.04 81.53,60.07 80.01,58.55 v80.01,57.15 | v74.3,46.35 73.99,46.66 73.99,50.3 U9.37
  Route2 0.254: v74.3,46.35 80.01,52.07 v80.01,57.15
  Route15 0.254: v74.88,78.11 77.47,75.52 77.47,70.1 v79.82,67.75
ADC5_START  (via drill 0.35)
  Top 0.254: U10.23 69.62,84.11 72.14,81.6 72.14,79.38 73.8,77.71 73.8,74.06 72.52,72.77 69.72,72.77 67.94,70.99 v67.31,70.99 | v74.93,50.04 75.14,50.04 U9.35
  Route2 0.254: v74.93,50.04 73.41,51.56 73.41,60.2 71.71,61.9 71.71,66.6 v67.31,70.99
ADC6_DRDY
  Top 0.254: U9.45 73.66,55.63 73.66,59.31 77.22,62.87 77.22,63.49 76.57,64.14 U12.25
ADC6_RES  (via drill 0.35)
  Top 0.254: U9.33 78.21,51.69 81.66,51.69 84.58,54.61 v84.58,63.25 | v75.81,72.64 76.21,72.64 76.58,72.26 76.58,70.83 U12.4
  Route2 0.254: v84.58,63.25 81.92,65.91 81.92,67.94 79.38,70.48 77.97,70.48 v75.81,72.64
ADC6_START  (via drill 0.35)
  Top 0.254: U12.23 75.27,63.84 75.11,63.67 v75.11,62.05 | v70.1,46.74 72.14,46.74 73.51,48.11 73.51,50.53 U9.38
  Route2 0.254: v70.1,46.74 68.96,47.88 68.96,51.05 68.33,51.69 68.33,57.53 63.63,62.23 61.67,62.23 v61.59,62.15
  Route15 0.254: v75.11,62.05 74.64,62.52 73.36,62.52 72.85,62.01 72.18,62.01 72.04,62.15 v61.59,62.15
DAPI_N  (via drill 0.35)
  Top 0.254: X3.D- 144.8,91.46 141.6,88.27 132.59,88.27 131.32,89.53 v130.68,89.53 IC13.6
  Bottom 0.254: D1.C 129.54,88.39 v130.68,89.53
DAPI_P  (via drill 0.35)
  Top 0.254: IC13.5 130.81,88.27 v131.32,87.76 131.83,87.25 142.24,87.25 143.26,88.27 153.09,88.27 155.13,90.31 X3.D+
  Bottom 0.254: v131.32,87.76 132.72,86.36 134.62,86.36 135.89,85.09 D2.C
DAPI_RX  (via drill 0.35)
  Top 0.254: U9.11 86.36,44.28 v86.36,44.45 | IC13.2 125.73,84.45 124.71,85.47 124.71,87.25 v125.73,88.27
  Bottom 0.254: v86.36,44.45 86.36,46.35 84.45,48.26 D4.C 76.45,48.26 75.82,48.9 75.82,50.8 74.93,51.69 74.93,57.78 79.38,62.23 90.81,62.23 100.97,72.39 107.31,72.39 116.2,81.28 116.2,83.31 117.02,84.12 117.02,84.63 120.65,88.27 v125.73,88.27
DAPI_TX  (via drill 0.35)
  Top 0.254: U9.43 74.93,55.48 74.93,57.02 76.33,58.42 v77.47,58.42 | IC13.3 126.36,85.72 v125.73,86.36
  Bottom 0.254: D3.C v77.47,58.42 80.64,61.59 91.44,61.59 100.97,71.12 107.31,71.12 116.84,80.64 116.84,81.92 121.28,86.36 v125.73,86.36
EXP_IN
  Top 0.254: D5.C 115.57,39.37 IC5.2 121.54,39.37 123.57,37.34 123.57,24 125.09,22.48 125.98,22.48 128.4,20.07 128.4,11.43 127.25,10.29 122.43,10.29 121.28,11.43 IC8.1
EXP_IN_N
  Top 0.254: IC5.7 129.41,39.37 130.81,40.77 R15.1 132.02,42.87 132.59,43.43 | X2.14 149.43,63.96 134.24,48.77 134.24,45.09 132.59,43.43 | R17.2 131.83,46.35 132.59,45.59 132.59,43.43
EXP_IN_OPT  (via drill 0.35)
  Top 0.254: IC8.8 121.28,21.46 120.46,22.29 R13.1 118.11,23.5 v117.22,24.38 | U9.200 86.36,32.06 v86.36,29.21
  Route15 0.254: v117.22,24.38 111.25,18.41 105.16,18.41 94.36,29.21 v86.36,29.21
  Bottom 0.254: D10.C 83.82,52.07 90.81,45.09 90.81,33.66 v86.36,29.21
EXP_IN_P  (via drill 0.35)
  Top 0.254: IC5.8 127.64,40.64 v127.95,40.96 128.14,41.15 R10.2 126.68,42.87 125.73,43.81 R16.2
  Route15 0.254: X2.13 149.07,61.19 128.84,40.96 v127.95,40.96
EXP_OUT  (via drill 0.35)
  Top 0.254: D6.C 110.49,41.27 111.44,42.23 v112.9,42.23 R14.1 | v117.09,38.1 IC5.3 121.67,38.1 123.06,36.7 123.06,23.75 123.83,22.99 IC8.6
  Bottom 0.254: v117.09,38.1 112.96,42.23 v112.9,42.23
EXP_OUT_N  (via drill 0.35)
  Top 0.254: IC5.6 129.54,38.1 135.38,43.94 135.38,48.64 149.35,62.61 v149.99,62.61
  Bottom 0.254: v149.99,62.61 149.99,64.39 150.94,65.34 X2.7
EXP_OUT_OPT
  Top 0.254: IC8.3 123.83,16.13 122.94,17.02 100.58,17.02 87,30.61 87,32.13 U9.201
EXP_OUT_P
  Top 0.254: X2.6 137.16,47.48 137.16,43.18 130.81,36.83 IC5.5
FL_1_CS1
  Top 0.254: U7.7 38.23,42.55 38.61,42.16 38.61,41.02 40.51,39.12 46.61,39.12 47.37,39.88 48.14,39.88 U9.104
FL_1_CS2
  Top 0.254: U9.102 50.67,38.76 50.67,38.1 49.78,37.21 36.07,37.21 33.91,39.37 33.91,43.18 34.54,43.81 U7.6
FL_1_HLD
  Top 0.254: U9.99 47.5,44.05 47.5,50.8 46.86,51.44 37.47,51.44 36.3,50.27 U7.1
FL_1_RES
  Top 0.254: U9.101 47.97,42.16 47.19,42.16 46.67,41.64 46.67,40.58 46.23,40.13 40.89,40.13 39.5,41.53 39.5,46.48 38.35,47.62 U7.3
FL_1_WP
  Top 0.254: U9.100 48.04,42.8 46.75,42.8 46.08,42.13 46.08,41.5 45.85,41.27 U7.9
FL_2_CS1  (via drill 0.35)
  Top 0.254: U8.7 38.35,27.3 v38.86,26.8 | U9.112 52.32,34.29 54.1,34.29 v54.23,34.16
  Route2 0.254: v38.86,26.8 38.99,26.8 40.05,27.86 42.29,30.1 49.53,30.1 53.59,34.16 v54.23,34.16
FL_2_CS2  (via drill 0.35)
  Top 0.254: U9.111 52.63,35.31 v52.96,35.31 | v39.24,28.19 38.86,28.57 U8.6
  Route2 0.254: v52.96,35.31 52.96,34.67 49.15,30.86 41.91,30.86 v39.24,28.19
FL_2_HLD  (via drill 0.35)
  Top 0.254: U9.109 48.77,32.86 v48.77,32.26 | v36.2,36.2 36.3,36.09 U8.1
  Route2 0.254: v48.77,32.26 40.13,32.26 v36.2,36.2
FL_2_RES
  Top 0.254: U8.3 38.61,32.38 40.89,30.1 40.89,24.77 41.02,24.64 45.97,24.64 47.75,26.42 47.75,29.59 49.78,31.62 49.78,33.16 U9.110
FL_2_WP
  Top 0.254: U9.108 46.99,31.79 46.99,26.85 46.18,26.04 U8.9
GND  (via drill 0.35)
  Top 0.254: X3.GND 155.96,93.96 161.12,88.81 161.12,84.37 158.78,82.03 LED4.C LED3.C LED2.C LED1.C LED5.C LED6.C 148.47,81.92 142.24,81.92 v139.06,78.74 | IC8.7 122.56,23.11 122.05,23.62 122.05,25.4 | IC6.5 121.41,34.29 122.05,33.66 122.05,31.75 | 122.05,25.4 122.05,27.94 | 122.05,27.94 122.05,31.75 | IC6.7 122.05,31.75 | IC7.5 122.05,27.94 | 122.05,25.4 IC7.7 115.7,25.4 v115,24.7 114.94,24.64 R12.1 | U6.3 U6.6 | U1.2 17.91,66.04 18.86,65.09 C8.1 | C8.1 21.91,65.09 v22.86,64.14 24.2,62.79 C7.- | R2.1 20.83,63.63 20.32,64.14 C8.1 | C16.1 57.32,21.42 57.32,22.31 U9.136 62.25,27.24 62.29,27.24 | C17.1 52.91,48.64 54.93,48.64 U9.82 57.5,46.07 | C18.2 79.54,54.83 79.06,55.31 C32.2 76.88,55.31 U9.40 72.39,50.82 72.39,50.34 v72.22,50.16 | IC13.1 128.43,79.86 | C1.2 129.41,78.87 128.43,79.86 | 128.43,79.86 128.26,79.69 v125.35,79.69 C33.2 118.42,79.69 117.47,80.64 117.47,87.7 114.66,90.53 | C19.2 44.77,85.41 44.32,85.85 44.32,87 43.38,87.94 U3.21 39.05,87.94 37.89,86.79 37,86.79 36.85,86.64 U3.10 33.38,86.64 32.51,87.5 v32.51,90.3 | 33.91,78.49 U4.3 U4.2 | 33.91,78.49 33.53,78.49 33.53,79.82 C4.1 | 33.91,78.49 v32.13,76.71 | v58.17,52.58 58.17,52.48 U9.72 v61.59,49.05 61.59,48.26 59.31,45.97 57.6,45.97 57.5,46.07 | U5.21 42.74,62.54 43.81,61.47 v43.81,60.33 | v31.5,29.46 31.42,29.39 C11.- 26.24,26.29 C13.1 v23.68,28.26 22.73,29.21 22.73,30.73 | 22.73,30.73 R6.1 | 22.73,30.73 24.13,30.73 24.64,31.24 24.64,34.8 23.3,36.13 C12.1 19.24,36.13 v18.99,36.39 18.29,37.08 U2.2 | v33.4,46.1 31.81,46.1 C9.1 | IC3.11 17.78,41.4 v17.91,41.27 | C30.2 41.27,53.34 v41.4,53.21 | IC4.11 19.68,11.43 22.86,8.26
  Top 0.254: 22.86,8.26 23.06,8.05 C15.- 35.99,8.05 37.47,9.53 37.47,15.11 | 37.47,15.11 37.47,19.3 v34.16,22.61 | v43.56,23.62 46.23,23.62 48.64,26.04 48.64,29.47 49.19,30.02 49.47,30.02 U9.114 53.1,33.66 53.59,33.66 53.89,33.35 53.9,33.35 56.13,31.11 56.22,31.11 | v40.39,44.07 40.39,43.31 41.15,42.55 U7.10 | v66.29,78.61 66.29,77.72 64.97,76.4 RN14.8 RN14.7 RN14.6 RN14.5 59.24,76.4 58.55,77.09 v58.55,77.98 | IC2.11 17.78,74.93 16.68,73.83 v16.68,73.41 | C40.- 114.66,90.53 | U9.122 56.22,31.11 | 59.44,30.1 58.42,31.11 56.22,31.11 | 59.44,30.1 59.69,29.84 | 59.69,29.84 62.29,27.24 | 62.29,27.24 66.67,22.86 66.67,21.59 66.29,21.21 65.41,21.21 U9.149 | U9.128 59.44,30.09 59.44,30.1 | 59.69,29.84 61.28,31.43 v62.87,31.43 63.31,31.88 v70.36,31.88 | U9.170 75.62,21.59 76.83,21.59 v80.64,25.4 80.64,26.46 U9.184 | RN17.5 RN17.6 RN17.7 RN17.8 76.2,91.88 | U10.2 U10.3 75.18,82.17 76.58,83.57 76.58,86.11 76.39,86.3 | U11.2 U11.3 85.97,75.31 v86.23,75.06 | 76.2,91.88 75.77,91.88 v74.3,93.34 | X_IN_9.GND@2 v2.03,10.79 X_IN_8.GND@1 | X_IN_9.GND@1 2.16,2.67 4.19,2.67 4.88,3.35 4.88,3.68 6.48,5.28 9.73,5.28 v11.56,7.11 21.72,7.11 22.86,8.26 | v99.06,104.78 98.93,104.65 X_IN_15.GND@3 | X_IN_15.GND@4 v87.63,104.65 X_IN_14.GND@2 | X_IN_14.GND@1 v76.2,104.65 X_IN_12.GND@2 | X_IN_12.GND@1 v64.77,104.65 X_IN_13.GND@2 | X_IN_13.GND@1 v53.34,104.65 X_IN_11.GND@2 | X_IN_11.GND@1 v41.91,104.65 X_IN_10.GND@2 | X_IN_10.GND@1 3.68,104.65 v2.86,103.82 2.03,103 X_IN_1.GND@2 | X_IN_1.GND@1 v2.03,90.81 X_IN_2.GND@2 | X_IN_2.GND@1 v2.03,79.38 X_IN_3.GND@2 | X_IN_3.GND@1 v2.03,67.94 X_IN_4.GND@2 | X_IN_4.GND@1 v2.03,56.52 X_IN_5.GND@2
  Top 0.254: X_IN_5.GND@1 v2.03,45.09 X_IN_6.GND@2 | X_IN_6.GND@1 v2.03,33.66 X_IN_7.GND@2 | X_IN_7.GND@1 v2.03,22.23 X_IN_8.GND@2 | v89.53,93.98 IC10.11 | U4.10 38.35,73.94 | 38.35,73.94 39.02,73.94 v39.62,74.55 40.11,75.03 40.29,75.03 40.49,75.24 U4.21 43.51,75.24 44.7,74.04 v44.7,72.01 | U9.93 53.5,42.29 54.61,42.29 57.5,45.18 57.5,46.07 | U9.60 65.41,53.72 v65.99,53.72 | U9.51 69.6,55.8 v69.6,54.23 | C2.2 115.82,94.23 114.66,93.06 114.66,90.53 | v91.57,74.42 91.75,74.23 C46.2 | U11.10 80.92,70.77 79.79,69.63 77.85,69.63 77.85,70.8 | 77.85,70.8 U12.2 77.87,75.33 80.01,77.47 v80.01,78.95 | U12.3 77.34,70.82 | 77.34,70.82 77.83,70.82 77.85,70.8 | v36.58,68.96 36.64,69.03 | 36.64,69.03 38.35,70.74 38.35,73.94 | 36.64,69.03 36.58,69.09 34.42,69.09 33.78,68.45 33.78,66.93 34.27,66.44 U5.2 U5.3 33.41,65.79 33.02,65.41 33.02,61.59 33.38,61.24 U5.10 37.44,61.24 37.85,60.83 v37.85,60.33 37.85,58.17 35.56,55.88 C10.- | 76.39,86.3 75.97,86.72 | 75.97,86.72 U10.10 70.71,86.72 | 76.39,86.3 79.44,86.3 80.33,85.41 C48.2 80.33,83.25 v81.66,81.92 | 75.97,86.72 75.97,91.65 76.2,91.88 | 70.71,86.72 69.41,85.42 U10.21 66.73,85.42 65.91,86.23 65.91,87.38 63.91,89.38 61.24,89.38 60.96,89.66 IC9.11 | v70.23,88.65 70.71,88.16 70.71,86.72 | U9.202 85.42,34.42 84.2,34.42 v83.19,33.4 | U12.10 72.67,70.01 73.05,69.63 76.84,69.63 77.34,70.13 77.34,70.82 | 100.58,73.41 100.97,73.03 IC1.5 100.97,64.77 98.42,62.23 94.69,62.23 C41.- | v81.06,49.32 81.06,48.88 U9.25 78.74,46.56 78.74,43.56 v79.5,42.8 | U9.14 82.8,42.85 82.8,41.27 v83.19,40.89 | U12.21 73.97,63.63 v73.66,63.33 | U3.2 U3.3 33.41,91.19 v32.51,90.3
  Top 0.254: v32.51,90.3 32.38,90.17 C5.- | U11.21 87.94,72.06 87.63,71.75 v87.63,70.28 | 37.47,15.11 47.12,15.11 | 47.12,15.11 v50.42,15.11 51.56,15.11 52.32,15.88 SJ_MS.1 | v46.16,28.33 46.16,27.7 45.77,27.3 U8.10 | JP_MS.1 47.24,15.24 47.12,15.11
  Top 0.762: C35.1 102.87,75.95 | 102.87,75.95 C37.1 101.41,74.23 100.58,73.41 100.46,73.28 94.17,73.28 C46.2 | U6.3 102.87,75.95 | U6.6 105.8,90.88 C40.- | C36.1 98.49,51.37 v97.33,52.53 C39.-
  Route2 0.254: v16.68,73.41 16.68,70.31 v22.86,64.14 | v80.01,78.95 82.12,78.95 82.55,79.38 85.09,79.38 86.23,78.23 v86.23,75.06 | X_PROG.10 84.99,18.26 80.64,22.61 v80.64,25.4 80.64,29.59 83.19,32.13 v83.19,33.4 v83.19,40.89 83.19,44.07 82.17,45.09 | v81.06,49.32 81.66,48.72 81.66,45.59 82.17,45.09 | v79.5,42.8 79.5,43.43 80.06,43.99 81.07,43.99 82.17,45.09 | v33.4,46.1 38.35,46.1 v40.39,44.07
  Route15 0.254: v69.6,54.23 66.5,54.23 v65.99,53.72
  Bottom 0.254: X_PROG.8 X_PROG.10 86.73,15.99 85.41,14.67 X_PROG.14 83.14,12.53 78.74,8.13 D11.A 76.83,8 D12.A | X_PROG.8 | X_PROG.8 X_PROG.6 | X_PROG.6 | X_PROG.6 X_PROG.4 X_PROG.2 | X_PROG.2 | X_PROG.2 93.96,25.4 112.39,25.4 | v115,24.7 114.3,25.4 112.39,25.4 | X1.1 141.15,13.51 137.79,10.16 114.94,10.16 112.39,12.7 112.39,25.4 | R23.1 v62.87,31.43 63.05,31.43 63.31,31.18 C52.1 66.23,31.18 66.67,31.62 U13.2 | 72.39,42.55 D9.A D8.A 72.39,33.91 v70.36,31.88 | 72.39,42.55 D7.A D4.A 72.26,48.39 72.26,50.16 | 72.26,50.16 72.26,51.94 D10.A D3.A | v139.06,78.74 D2.A D1.A 128.59,79.69 v125.35,79.69 | v32.13,76.71 33.34,77.92 C22.2 | RN2.5 RN2.6 RN2.7 RN2.8 30.05,82.35 30.48,81.92 | 30.48,81.92 32.13,80.26 v32.13,76.71 | v58.17,52.58 57.19,53.56 C31.2 | v43.81,60.33 45.28,60.33 C26.2 | v31.5,29.46 33.34,31.31 C29.2 43.19,31.31 v46.16,28.33 46.16,26.23 v43.56,23.62 | C14.1 18.92,33.78 19.18,34.04 19.18,36.2 v18.99,36.39 19.05,36.45 19.05,39.37 17.91,40.51 v17.91,41.27 17.91,45.21 20.75,48.06 RN5.5 | RN5.5 RN5.6 RN5.7 RN5.8 31.44,48.06 v33.4,46.1 | v23.68,28.26 23.68,24.58 25.6,22.66 RN8.5 RN8.6 RN8.7 RN8.8 34.11,22.66 v34.16,22.61 | C6.1 22.67,51.12 23.62,50.16 23.62,48.77 24.33,48.06 RN5.5 | v40.39,44.07 40.39,47.56 C28.2 41.4,49.98 v41.4,53.21 43.81,55.63 v43.81,60.33 | C54.1 57.21,80.58 58.55,79.25 58.55,78.11 | 58.55,78.11 v58.55,77.98 | C50.2 79.76,78.49 80.01,78.74 v80.01,78.95 80.01,81.28 | 80.01,81.28 C57.1 | 70.17,80.96 70.17,80.97 C49.2 70.17,83.12 69.6,83.69 69.6,86.49 70.17,87.06 C47.2 71.12,87.76 v70.23,88.65 | 70.17,80.96 67.82,78.61 v66.29,78.61 C55.1 67.5,77.28 67.94,76.83 67.94,74.3 67.31,73.66 66.67,73.66 66.04,73.03 66.04,69.85 67.56,68.33 C53.2 71.06,62.93 72.39,61.59 72.39,61.34
  Bottom 0.254: v74.3,93.34 74.74,92.9 C58.1 77.28,93.98 v89.53,93.98 | 72.26,50.16 v72.22,50.16 | v11.56,7.11 11.05,7.62 X_IN_9.GND@2 | X_IN_9.GND@2 X_IN_9.GND@1 | v99.06,104.78 98.93,104.65 X_IN_15.GND@3 X_IN_15.GND@4 v87.63,104.65 X_IN_14.GND@2 X_IN_14.GND@1 v76.2,104.65 X_IN_12.GND@2 X_IN_12.GND@1 v64.77,104.65 X_IN_13.GND@2 X_IN_13.GND@1 v53.34,104.65 X_IN_11.GND@2 X_IN_11.GND@1 v41.91,104.65 X_IN_10.GND@2 X_IN_10.GND@1 3.68,104.65 v2.86,103.82 2.03,103 X_IN_1.GND@2 X_IN_1.GND@1 v2.03,90.81 X_IN_2.GND@2 X_IN_2.GND@1 v2.03,79.38 X_IN_3.GND@2 X_IN_3.GND@1 v2.03,67.94 X_IN_4.GND@2 X_IN_4.GND@1 v2.03,56.52 X_IN_5.GND@2 X_IN_5.GND@1 v2.03,45.09 X_IN_6.GND@2 X_IN_6.GND@1 v2.03,33.66 X_IN_7.GND@2 X_IN_7.GND@1 v2.03,22.23 X_IN_8.GND@2 X_IN_8.GND@1 v2.03,10.79 X_IN_9.GND@2 | v44.7,72.01 C23.2 | v61.59,49.05 65.99,53.44 v65.99,53.72 | D3.A 71.25,55.88 v69.6,54.23 | v86.23,75.06 90.93,75.06 v91.57,74.42 91.57,72.52 89.33,70.28 v87.63,70.28 | v39.62,74.55 37.78,72.71 C24.2 33.34,72.71 31.57,74.47 31.57,76.15 v32.13,76.71 | v36.58,68.96 36.39,69.15 C25.2 27.87,69.15 v22.86,64.14 | C45.2 73.03,78.74 70.8,80.96 70.17,80.96 | v73.66,63.33 73.66,62.61 72.39,61.34 | 72.39,61.34 D3.A | C27.2 37.28,59.76 v37.85,60.33 v43.81,60.33 | C20.2 32.7,90.49 v32.51,90.3 32.51,86.55 C21.2 32.07,84.78 | 30.48,81.92 30.48,83.19 32.07,84.78 | C3.1 31.43,85.41 32.07,84.78 | 72.39,42.55 79.25,42.55 v79.5,42.8 | v56.9,65.91 56.9,72.64 56.52,73.03 56.52,76.07 58.55,78.11 | v97.33,52.53 97.33,61.77 IC1.5 | v81.66,81.92 81.03,81.28 80.01,81.28 | R27.2 83.06,25.28 v82.93,25.4 v80.64,25.4
  other vias: 51.05,22.1 70.1,15.11 80.26,6.86 92.33,17.02 97.79,21.84 97.28,28.32 99.06,35.69 97.92,41.53 96.9,49.28 91.31,49.15 95.89,56.13 103.25,59.05 104.14,67.18 115.82,75.69 127,75.82 157.86,95.12 155.19,103.38 143.76,104.65 133.6,104.65 123.44,104.65 110.11,104.65 96.77,84.33 96.77,86.87 96.77,89.41 96.77,91.95 98.68,93.85 101.22,93.85 103.76,93.85 106.3,93.85 109.47,88.77 109.47,86.23 109.47,92.58 97.41,79.88 91.06,79.25 88.52,64.01 88.52,58.93 58.04,63.37 49.28,65.91 49.53,70.36 42.8,69.6 47.88,56.13 33.53,57.28 34.16,51.56 48.39,45.85 53.09,38.61 39.12,38.86 31.75,32.89 11.3,55.37 11.18,79.88 16.64,88.77 12.06,95.12 18.67,95.12 33.02,95 41.15,95.12 24.38,103.76 13.08,103.89 23.5,6.73 76.2,26.67 70.99,21.21 78.74,31.75 38.61,43.94 48.01,36.2 117.35,73.66 121.92,72.39 127.76,71.12 139.57,73.53
  pour Top (isolate 0.305, rank 2): 0,106.68 0,0 162.81,0 162.81,106.68
  pour Bottom (isolate 0.305, rank 2): 162.81,106.68 162.81,0 0,0 0,106.68
  pour Route2 (isolate 0.305, rank 2): 162.81,106.68 162.81,0 0,0 0,106.68
  pour Route15 (isolate 0.305, rank 2): 162.81,106.68 162.81,0 0,0 0,106.68
IN_DMS_1  (via drill 0.35)
  Top 0.254: X_IN_1.P 5.08,96.52 10.79,90.81 10.79,87.63 12.7,85.72 17.78,85.72 v18.73,84.77 20.32,83.19 IC2.2
  Bottom 0.254: RN3.4 24.13,76.83 18.73,82.23 v18.73,84.77
IN_DMS_2  (via drill 0.35)
  Top 0.254: X_IN_2.P 10.79,85.09 12.06,83.82 v14.61,83.82 15.24,83.19 IC2.6
  Bottom 0.254: RN3.3 23.5,75.56 15.24,83.82 v14.61,83.82
IN_DMS_3  (via drill 0.35)
  Top 0.254: X_IN_3.P v13.34,73.66 14.61,73.66 15.24,74.3 IC2.9
  Bottom 0.254: RN3.2 13.97,74.3 v13.34,73.66
IN_DMS_4  (via drill 0.35)
  Top 0.254: X_IN_4.P 6.99,62.23 10.79,66.04 10.79,70.48 12.7,72.39 19.05,72.39 v19.68,73.03 20.32,73.66 IC2.13
  Bottom 0.254: RN3.1 v19.68,73.03
IN_DMS_5  (via drill 0.35)
  Top 0.254: X_IN_5.P v12.95,50.8 14.61,50.8 19.68,50.8 20.32,50.16 IC3.2
  Route15 0.254: v32.77,37.85 32,37.08 28.19,37.08 27.18,38.1 14.48,38.1 12.83,39.75 12.83,46.1 11.81,47.12 11.81,48.77 12.95,49.91 v12.95,50.8
  Bottom 0.254: RN6.4 31.57,41.71 32.77,40.51 v32.77,37.85
IN_DMS_6  (via drill 0.35)
  Top 0.254: X_IN_6.P 7.62,39.37 v11.43,43.18 11.43,44.45 12.7,45.72 14.61,45.72 15.24,46.35 IC3.6
  Route15 0.254: v32.64,36.07 32.51,35.94 21.46,35.94 20.7,35.18 14.1,35.18 11.43,37.85 v11.43,43.18
  Bottom 0.254: RN6.3 29.21,42.42 29.59,42.8 32,42.8 33.78,41.02 33.78,37.21 v32.64,36.07
IN_DMS_7  (via drill 0.35)
  Top 0.254: X_IN_10.P 36.2,98.42 38.1,96.52 45.09,96.52 53.34,88.27 57.15,88.27 58.42,87 IC9.2 58.42,81.66 v59.05,81.03
  Bottom 0.254: v59.05,81.03 59.18,81.15 59.69,81.15 61.59,81.15 61.98,81.53 61.98,83.77 RN15.4
IN_DMS_7_NC  (via drill 0.35)
  Top 0.254: v15.62,45.47 15.24,45.09 IC3.9
  Route15 0.254: v30.86,43.69 30.86,45.09 30.35,45.59 25.27,45.59 23.5,43.81 17.27,43.81 v15.62,45.47
  Bottom 0.254: RN6.2 27.94,42.8 28.4,43.26 28.83,43.69 v30.86,43.69
IN_DMS_8  (via drill 0.35)
  Top 0.254: X_IN_11.P 47.62,97.16 55.88,88.9 61.98,88.9 63.5,87.38 IC9.6 63.5,83.7 63.07,83.27 v63.07,82.04
  Bottom 0.254: RN15.3 62.87,85.09 63.37,84.58 63.37,83.57 63.07,83.27 v63.07,82.04
IN_DMS_8_NC  (via drill 0.35)
  Top 0.254: IC3.13 20.32,41.53 v20.7,41.15
  Bottom 0.254: RN6.1 26.42,41.96 21.52,41.96 v20.7,41.15
IN_DMS_9  (via drill 0.35)
  Top 0.254: IC9.9 v63.5,93.34 70.48,100.33 X_IN_12.P
  Bottom 0.254: RN15.2 62.74,86.36 63.5,87.12 v63.5,93.34
IN_DMS_10  (via drill 0.35)
  Top 0.254: IC9.13 v58.42,93.09 58.42,96.52 59.05,97.16 X_IN_13.P
  Bottom 0.254: RN15.1 62.03,88.59 58.42,92.2 v58.42,93.09
IN_DMS_11  (via drill 0.35)
  Top 0.254: X_IN_14.P 81.92,96.14 84.33,93.73 v84.33,91.95 84.33,90.42 87,87.76 IC10.2
  Bottom 0.254: RN18.4 85.47,90.81 v84.33,91.95
IN_DMS_12  (via drill 0.35)
  Top 0.254: X_IN_15.P 93.34,96.27 95.38,94.23 95.38,89.28 94.61,88.52 92.58,88.52 92.08,88.01 IC10.6 92.08,83.82 v91.95,83.69
  Route2 0.254: v91.95,83.69 86.87,88.77 v86.87,89.28
  Bottom 0.254: v86.87,89.28 87.12,89.53 RN18.3
IN_PT_1  (via drill 0.35)
  Top 0.254: X_IN_7.P 6.35,27.94 8.26,26.04 8.26,24.77 11.43,21.59 21.59,21.59 22.23,20.95 v22.23,20.83 IC4.2
  Bottom 0.254: RN9.4 24.64,18.41 v22.23,20.83
IN_PT_2  (via drill 0.35)
  Top 0.254: X_IN_8.P v15.37,16.51 16.51,16.51 17.14,17.14 IC4.6
  Bottom 0.254: RN9.3 16,17.14 v15.37,16.51
IN_PT_3  (via drill 0.35)
  Top 0.254: IC4.9 v17.14,11.43 15.24,9.53 9.27,9.53 4.83,5.08 X_IN_9.P
  Bottom 0.254: RN9.2 19.3,15.88 17.14,13.72 v17.14,11.43
IN_PT_4_NC  (via drill 0.35)
  Top 0.254: v22.61,11.81 22.23,12.19 IC4.13
  Bottom 0.254: RN9.1 25.91,14.61 23.11,11.81 v22.61,11.81
INTERSPU_RX  (via drill 0.35)
  Top 0.254: U9.166 78,16.38 v78.49,16.38
  Route2 0.254: X1.4 135.74,21.82 v132.84,18.92
  Route15 0.254: v78.49,16.38 82.68,12.19 126.11,12.19 v132.84,18.92
  Bottom 0.254: D11.C 76.96,14.61 78.49,16.13 v78.49,16.38
INTERSPU_TX  (via drill 0.35)
  Top 0.254: U9.163 73.33,18.92 74.3,18.92 76.43,16.79 v76.43,15.98
  Route2 0.254: X1.3 135,19.05 v132.97,17.02
  Route15 0.254: v132.97,17.02 126.87,10.92 81.48,10.92 v76.43,15.98
  Bottom 0.254: D12.C 72.9,14.73 73.66,15.49 75.95,15.49 v76.43,15.98
LED_1
  Top 0.254: U9.24 92.57,59.69 99.19,59.69 113.79,74.3 115.57,74.3 116.21,74.93 118.11,74.93 118.62,74.42 133.42,74.42 RN10.1
LED_2
  Top 0.254: U9.23 92.77,59.18 99.57,59.18 113.41,73.03 116.84,73.03 117.01,72.85 117.68,72.85 117.86,73.03 121.41,73.03 121.58,73.2 129.75,73.2 129.92,73.03 RN10.2
LED_3
  Top 0.254: U9.22 92.97,58.67 99.95,58.67 112.9,71.63 121.54,71.63 121.58,71.58 122.26,71.58 122.43,71.75 127.25,71.75 127.43,71.93 128.1,71.93 128.27,71.75 RN10.3
LED_4
  Top 0.254: U9.21 93.17,58.17 100.2,58.17 112.35,70.31 128.1,70.31 128.27,70.48 RN10.4
LO  (via drill 0.35)
  Top 0.254: IC7.2 128.02,25.4 v128.65,26.04 | v139.06,47.5 151.37,59.8 X2.5
  Route15 0.254: X1.7 148.96,17.67 137.1,29.53 v137.1,31.94
  Bottom 0.254: v128.65,26.04 131.19,26.04 v137.1,31.94 139.06,33.91 v139.06,47.5
LO_OPT  (via drill 0.35)
  Top 0.254: v80.64,43.18 80.77,43.05 80.77,40.51 83.82,37.47 86.61,37.47 U9.208 89.02,35.05 89.66,35.05 91.95,37.34 v93.09,37.34 RN12.6 | v118.49,24.38 118.75,24.13 IC7.8
  Bottom 0.254: v80.64,43.18 79.38,44.45 D7.C | v93.09,37.34 99.57,30.86 114.81,30.86 118.49,27.18 v118.49,24.38
MS_SEL
  Top 0.254: R29.1 55.3,18.24 54.54,18.99 SJ_MS.2 | SJ_MS.2 50.6,18.99 49.91,19.68 JP_MS.2 | SJ_MS.2 52.32,22.27 U9.129
N$1
  Top 0.254: Q1.2 135.89,92.71 134.37,94.23 C2.1 131.79,93.05 130.81,92.08 IC13.8
N$3  (via drill 0.35)
  Top 0.254: C1.1 v133.44,80.39 133.44,80.73 135.51,82.8 Q1.1 | IC13.7 v131.95,90.81
  Route15 0.254: v131.95,90.81 132.72,90.04 132.72,81.11 v133.44,80.39
N$4
  Top 0.254: R4.2 15.24,62.1 | 15.24,62.1 R1.2 | R3.1 16.19,68.89 15.24,67.94 15.24,62.1
N$5
  Top 0.254: R1.1 12.26,64.58 12.77,65.09 U1.5
N$6
  Top 0.254: R4.1 18.48,60.9 18.86,60.52 R2.2
N$7  (via drill 0.35)
  Top 0.254: RN1.5 v24.77,78.74 | IC2.3 19.05,79.63 v18.41,78.99
  Route15 0.254: v18.41,78.99 18.67,78.74 v24.77,78.74
  Bottom 0.254: v24.77,78.74 RN2.4
N$9  (via drill 0.35)
  Top 0.254: RN1.6 v26.04,78.74 | v17.27,78.99 16.51,79.76 IC2.5
  Route15 0.254: v26.04,78.74 25.02,77.72 18.54,77.72 17.61,78.66 v17.27,78.99
  Bottom 0.254: v26.04,78.74 RN2.3
N$14  (via drill 0.35)
  Top 0.254: RN1.7 v27.3,78.74 | v16.71,78.05 16.51,77.85 IC2.10
  Route15 0.254: v27.3,78.74 25.53,76.96 17.8,76.96 v16.71,78.05
  Bottom 0.254: v27.3,78.74 RN2.2
N$15  (via drill 0.35)
  Top 0.254: RN1.8 v28.57,78.74 | IC2.12 19.05,74.37 v18.16,73.48
  Route2 0.254: v18.16,73.48 18.16,72.9 18.92,72.14 20.83,72.14 21.84,73.15 28.57,73.15 31.11,75.69 31.11,77.72 30.1,78.74 v28.57,78.74
  Bottom 0.254: v28.57,78.74 RN2.1
N$16  (via drill 0.35)
  Top 0.254: L1.2 v20.95,90.17 C5.+ | v16.64,84.58 17.78,83.44 IC2.4
  Bottom 0.254: v20.95,90.17 20.95,89.53 21.56,88.93 21.56,87.34 C3.2 19.36,87.31 v16.64,84.58
N$17  (via drill 0.35)
  Top 0.254: RN4.5 24.77,45.47 24.26,44.96 v23.37,44.96 22.48,45.85 20.19,45.85 19.05,46.99 IC3.3
  Bottom 0.254: RN5.4 24.77,45.21 24.51,44.96 v23.37,44.96
N$18  (via drill 0.35)